# EAGLE design 1500015_ICLED_Featherwing_HW-V1-0 (EAGLE 7.5.0)

## Sheet 1 of 7
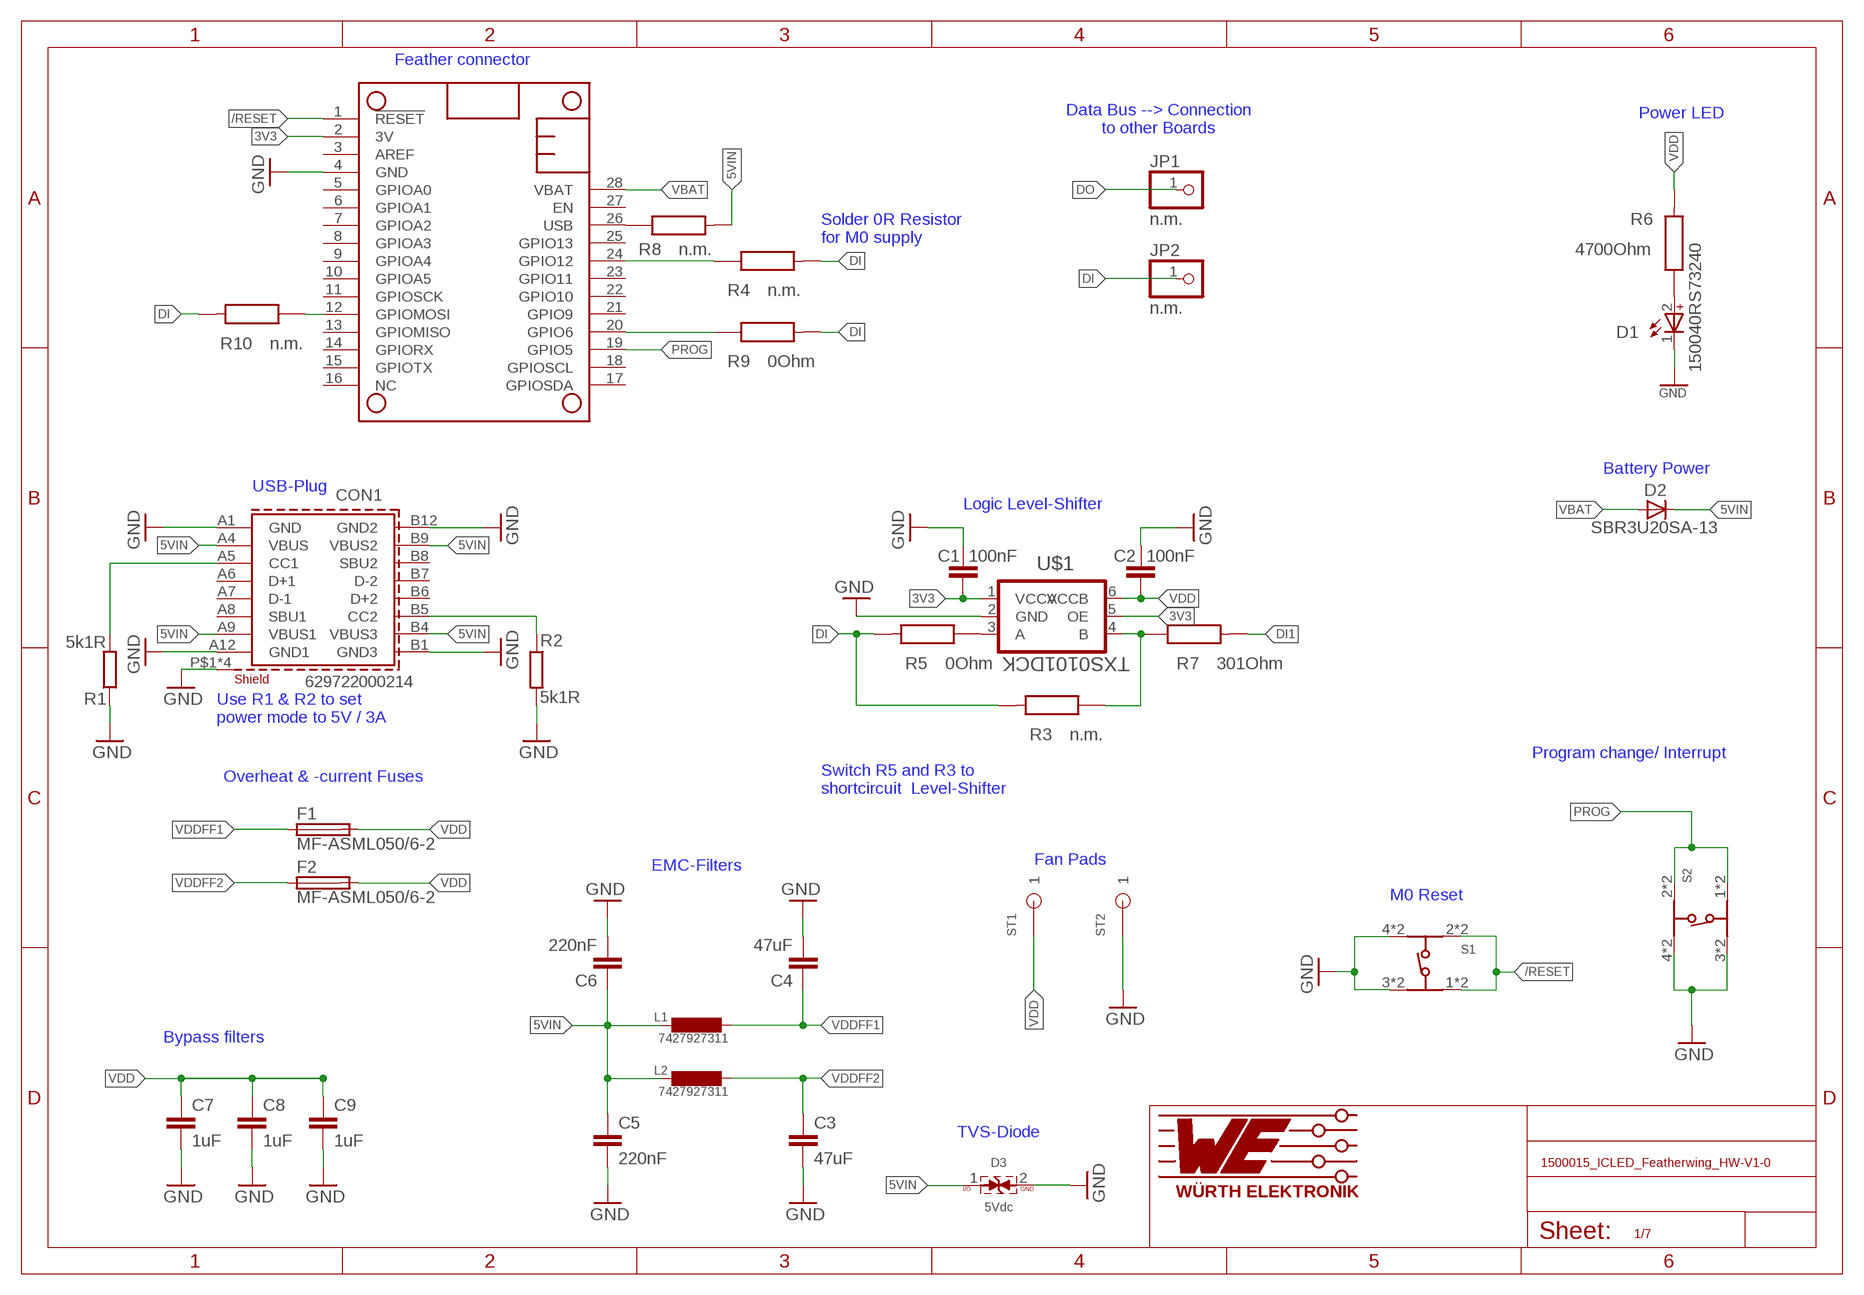
[diagram p0: schematic, sheet 1]

### Parts
C1  100nF  C100NF0402_IPC  [C0402_IPC]
C2  100nF  C100NF0402_IPC  [C0402_IPC]
C3  47uF  C0805  [C0805]
C4  47uF  C0805  [C0805]
C5  220nF  C220N0603_IPC  [C0603_IPC]
C6  220nF  C220N0603_IPC  [C0603_IPC]
C7  1uF  C1UF0402_IPC  [C0402_IPC]
C8  1uF  C1UF0402_IPC  [C0402_IPC]
C9  1uF  C1UF0402_IPC  [C0402_IPC]
CON1  629722000214  [629722000214]
D1  150040RS73240  WL-SMCC_0402_150040RS73240  [WL-SMCC_0402]
D2  SBR3U20SA-13  [SBR3U20SA]
D3  5Vdc  WE-TVS_DFN1610-2L_824032815  [WE-TVS_DFN1610-2L]
F1  MF-ASML050/6-2  ERB-RD2R00X  [0402]
F2  MF-ASML050/6-2  ERB-RD2R00X  [0402]
JP1  n.m.  PINHD-1X1/R  [1X01/R]
JP2  n.m.  PINHD-1X1/R  [1X01/R]
L1  7427927311  LL0402_WE_FERRIT  [L0402_WE_FERRIT]
L2  7427927311  LL0402_WE_FERRIT  [L0402_WE_FERRIT]
MS1  FEATHERWING  [FEATHERWING]
R1  5k1R  R10KR0402_IPC  [R0402_IPC]
R2  5k1R  R10KR0402_IPC  [R0402_IPC]
R3  n.m.  WRIS-RSKS_0603_560112116001_WAVE  [WRIS-RSKS_0603_WAVE]
R4  n.m.  WRIS-RSKS_0402_560112110001  [WRIS-RSKS_0402]
R5  0Ohm  WRIS-RSKS_0603_560112116001_WAVE  [WRIS-RSKS_0603_WAVE]
R6  4700Ohm  WRIS-RSKS_0402_560112110245  [WRIS-RSKS_0402]
R7  301Ohm  WRIS-RSKS_0402_560112110092  [WRIS-RSKS_0402]
R8  n.m.  WRIS-RSKS_0402_560112110001  [WRIS-RSKS_0402]
R9  0Ohm  WRIS-RSKS_0603_560112116001_WAVE  [WRIS-RSKS_0603_WAVE]
R10  n.m.  WRIS-RSKS_0603_560112116001_WAVE  [WRIS-RSKS_0603_WAVE]
S1  434331013822  434331013822_ANGEPASST  [434331013822_ICLEDFW_ANGEPASST]
S2  434331013822  434331013822_ANGEPASST  [434331013822_ICLEDFW_ANGEPASST]
ST1  1_5X1MM  [1_5X1MM]
ST2  1_5X1MM  [1_5X1MM]
U$1  TXS0101DCK  [SC70]

### Nets
3V3: C1.2 MS1.2(3V) U$1.1(VCCA) U$1.5(OE)
5VIN: C5.1 C6.1 CON1.A4(VBUS) CON1.A9(VBUS1) CON1.B4(VBUS3) CON1.B9(VBUS2) D2.K(C) D3.1(I/O) L1.P$2 L2.P$2 R8.2
/RESET: MS1.1(!RESET) S1.1 S1.2 S1.7 S1.8
DI: JP2.1 R3.2 R4.2 R5.2 R9.2 R10.2
DI1: R7.2 ; also sheet 2
DILS: R3.1 R7.1 U$1.4(B)
DO: JP1.1 ; also sheet 7
GND: C1.1 C2.1 C3.P$2 C4.P$2 C5.2 C6.2 C7.2 C8.2 C9.2 CON1.A1(GND) CON1.A12(GND1) CON1.B1(GND3) CON1.B12(GND2) CON1.P$1(SHIELD) CON1.P$2(SHIELD) CON1.P$3(SHIELD) CON1.P$4(SHIELD) D1.1(-) D3.2(GND) MS1.4(GND) R1.1 R2.2 S1.3 S1.4 S1.5 S1.6 S2.3 S2.4 S2.5 S2.6 ST2.1 U$1.2(GND) ; also sheet 2,3,4,5,6,7
GPIO6: MS1.20(GPIO6) R9.1
GPIO12: MS1.24(GPIO12) R4.1
MOSI: MS1.12(GPIOMOSI) R10.1
N$2: CON1.A5(CC1) R1.2
N$3: CON1.B5(CC2) R2.1
N$5: R5.1 U$1.3(A)
N$6: D1.2(+) R6.1
PROG: MS1.19(GPIO5) S2.1 S2.2 S2.7 S2.8
USB: MS1.26(USB) R8.1
VBAT: D2.A MS1.28(VBAT)
VDD: C2.2 C7.1 C8.1 C9.1 F1.2 F2.2 R6.2 ST1.1 U$1.6(VCCB) ; also sheet 2,3,4,5,6,7
VDDFF1: C4.P$1 F1.1 L1.P$1
VDDFF2: C3.P$1 F2.1 L2.P$1
Unconnected: CON1.A6(D+1) CON1.A7(D-1) CON1.A8(SBU1) CON1.B6(D+2) CON1.B7(D-2) CON1.B8(SBU2) MS1.3(AREF) MS1.5(GPIOA0) MS1.6(GPIOA1) MS1.7(GPIOA2) MS1.8(GPIOA3) MS1.9(GPIOA4) MS1.10(GPIOA5) MS1.11(GPIOSCK) MS1.13(GPIOMISO) MS1.14(GPIORX) MS1.15(GPIOTX) MS1.16(NC) MS1.17(GPIOSDA) MS1.18(GPIOSCL) MS1.21(GPIO9) MS1.22(GPIO10) MS1.23(GPIO11) MS1.25(GPIO13) MS1.27(EN)

### Notes on the sheet
- Feather connector
- Data Bus --> Connection
  to other Boards
- Power LED
- Solder 0R Resistor
  for M0 supply
- Battery Power
- USB-Plug
- Logic Level-Shifter
- Use R1 & R2 to set
  power mode to 5V / 3A
- Program change/ Interrupt
- Overheat & -current Fuses
- Switch R5 and R3 to 
  shortcircuit  Level-Shifter
- EMC-Filters | Fan Pads
- M0 Reset
- Bypass filters
- TVS-Diode

## Sheet 2 of 7
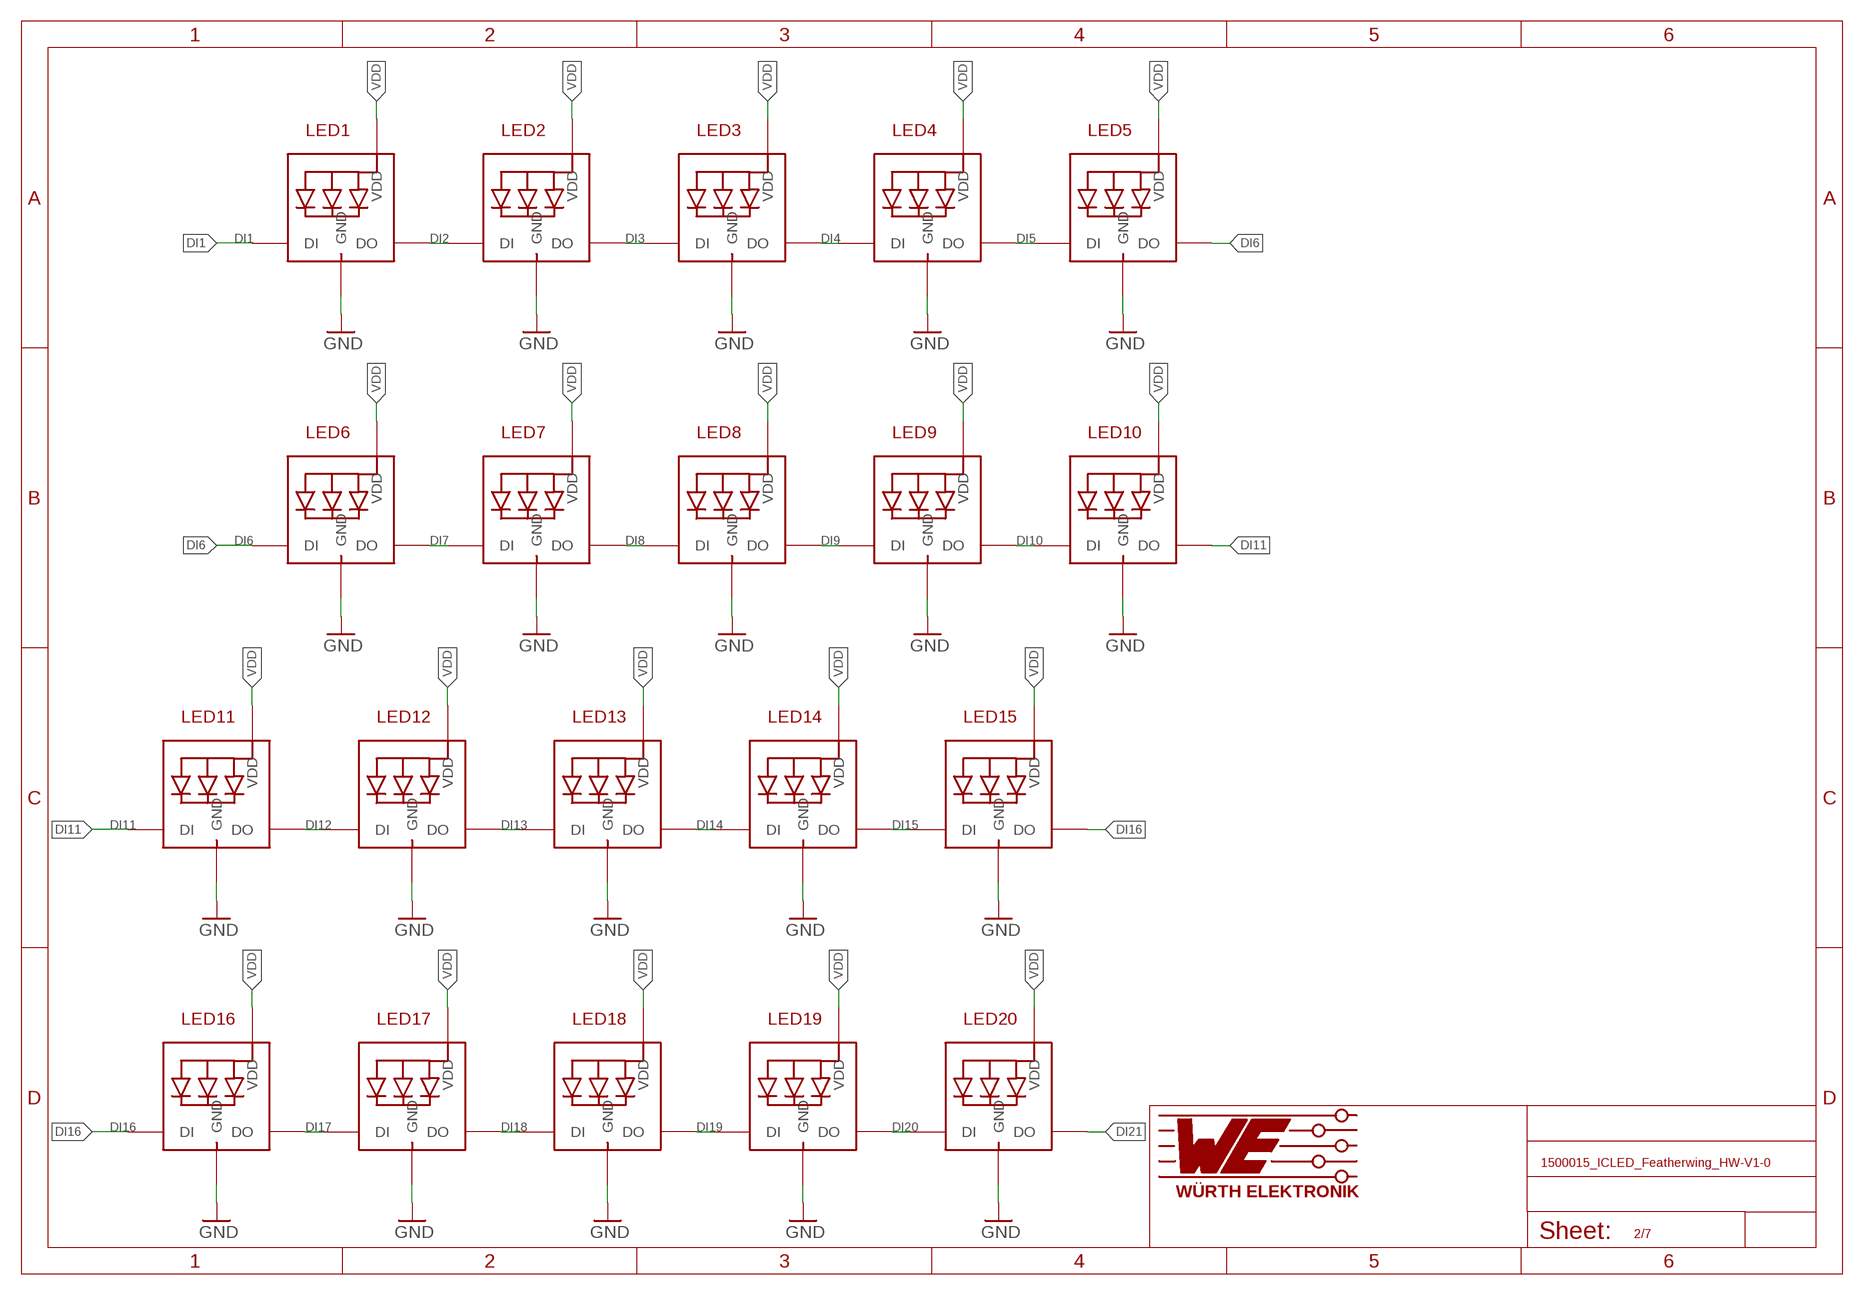
[diagram p1: schematic, sheet 2]

### Parts
LED1  1312020030000  [1312020030000_FWANGEPASST]
LED2  1312020030000  [1312020030000_FWANGEPASST]
LED3  1312020030000  [1312020030000_FWANGEPASST]
LED4  1312020030000  [1312020030000_FWANGEPASST]
LED5  1312020030000  [1312020030000_FWANGEPASST]
LED6  1312020030000  [1312020030000_FWANGEPASST]
LED7  1312020030000  [1312020030000_FWANGEPASST]
LED8  1312020030000  [1312020030000_FWANGEPASST]
LED9  1312020030000  [1312020030000_FWANGEPASST]
LED10  1312020030000  [1312020030000_FWANGEPASST]
LED11  1312020030000  [1312020030000_FWANGEPASST]
LED12  1312020030000  [1312020030000_FWANGEPASST]
LED13  1312020030000  [1312020030000_FWANGEPASST]
LED14  1312020030000  [1312020030000_FWANGEPASST]
LED15  1312020030000  [1312020030000_FWANGEPASST]
LED16  1312020030000  [1312020030000_FWANGEPASST]
LED17  1312020030000  [1312020030000_FWANGEPASST]
LED18  1312020030000  [1312020030000_FWANGEPASST]
LED19  1312020030000  [1312020030000_FWANGEPASST]
LED20  1312020030000  [1312020030000_FWANGEPASST]

### Nets
DI1: LED1.3-DIN(DI) ; also sheet 1
DI2: LED1.1-DOUT(DO) LED2.3-DIN(DI)
DI3: LED2.1-DOUT(DO) LED3.3-DIN(DI)
DI4: LED3.1-DOUT(DO) LED4.3-DIN(DI)
DI5: LED4.1-DOUT(DO) LED5.3-DIN(DI)
DI6: LED5.1-DOUT(DO) LED6.3-DIN(DI)
DI7: LED6.1-DOUT(DO) LED7.3-DIN(DI)
DI8: LED7.1-DOUT(DO) LED8.3-DIN(DI)
DI9: LED8.1-DOUT(DO) LED9.3-DIN(DI)
DI10: LED9.1-DOUT(DO) LED10.3-DIN(DI)
DI11: LED10.1-DOUT(DO) LED11.3-DIN(DI)
DI12: LED11.1-DOUT(DO) LED12.3-DIN(DI)
DI13: LED12.1-DOUT(DO) LED13.3-DIN(DI)
DI14: LED13.1-DOUT(DO) LED14.3-DIN(DI)
DI15: LED14.1-DOUT(DO) LED15.3-DIN(DI)
DI16: LED15.1-DOUT(DO) LED16.3-DIN(DI)
DI17: LED16.1-DOUT(DO) LED17.3-DIN(DI)
DI18: LED17.1-DOUT(DO) LED18.3-DIN(DI)
DI19: LED18.1-DOUT(DO) LED19.3-DIN(DI)
DI20: LED19.1-DOUT(DO) LED20.3-DIN(DI)
DI21: LED20.1-DOUT(DO) ; also sheet 3
GND: LED1.4-GND(GND) LED2.4-GND(GND) LED3.4-GND(GND) LED4.4-GND(GND) LED5.4-GND(GND) LED6.4-GND(GND) LED7.4-GND(GND) LED8.4-GND(GND) LED9.4-GND(GND) LED10.4-GND(GND) LED11.4-GND(GND) LED12.4-GND(GND) LED13.4-GND(GND) LED14.4-GND(GND) LED15.4-GND(GND) LED16.4-GND(GND) LED17.4-GND(GND) LED18.4-GND(GND) LED19.4-GND(GND) LED20.4-GND(GND) ; also sheet 1,3,4,5,6,7
VDD: LED1.2-VDD(VDD) LED2.2-VDD(VDD) LED3.2-VDD(VDD) LED4.2-VDD(VDD) LED5.2-VDD(VDD) LED6.2-VDD(VDD) LED7.2-VDD(VDD) LED8.2-VDD(VDD) LED9.2-VDD(VDD) LED10.2-VDD(VDD) LED11.2-VDD(VDD) LED12.2-VDD(VDD) LED13.2-VDD(VDD) LED14.2-VDD(VDD) LED15.2-VDD(VDD) LED16.2-VDD(VDD) LED17.2-VDD(VDD) LED18.2-VDD(VDD) LED19.2-VDD(VDD) LED20.2-VDD(VDD) ; also sheet 1,3,4,5,6,7

## Sheet 3 of 7
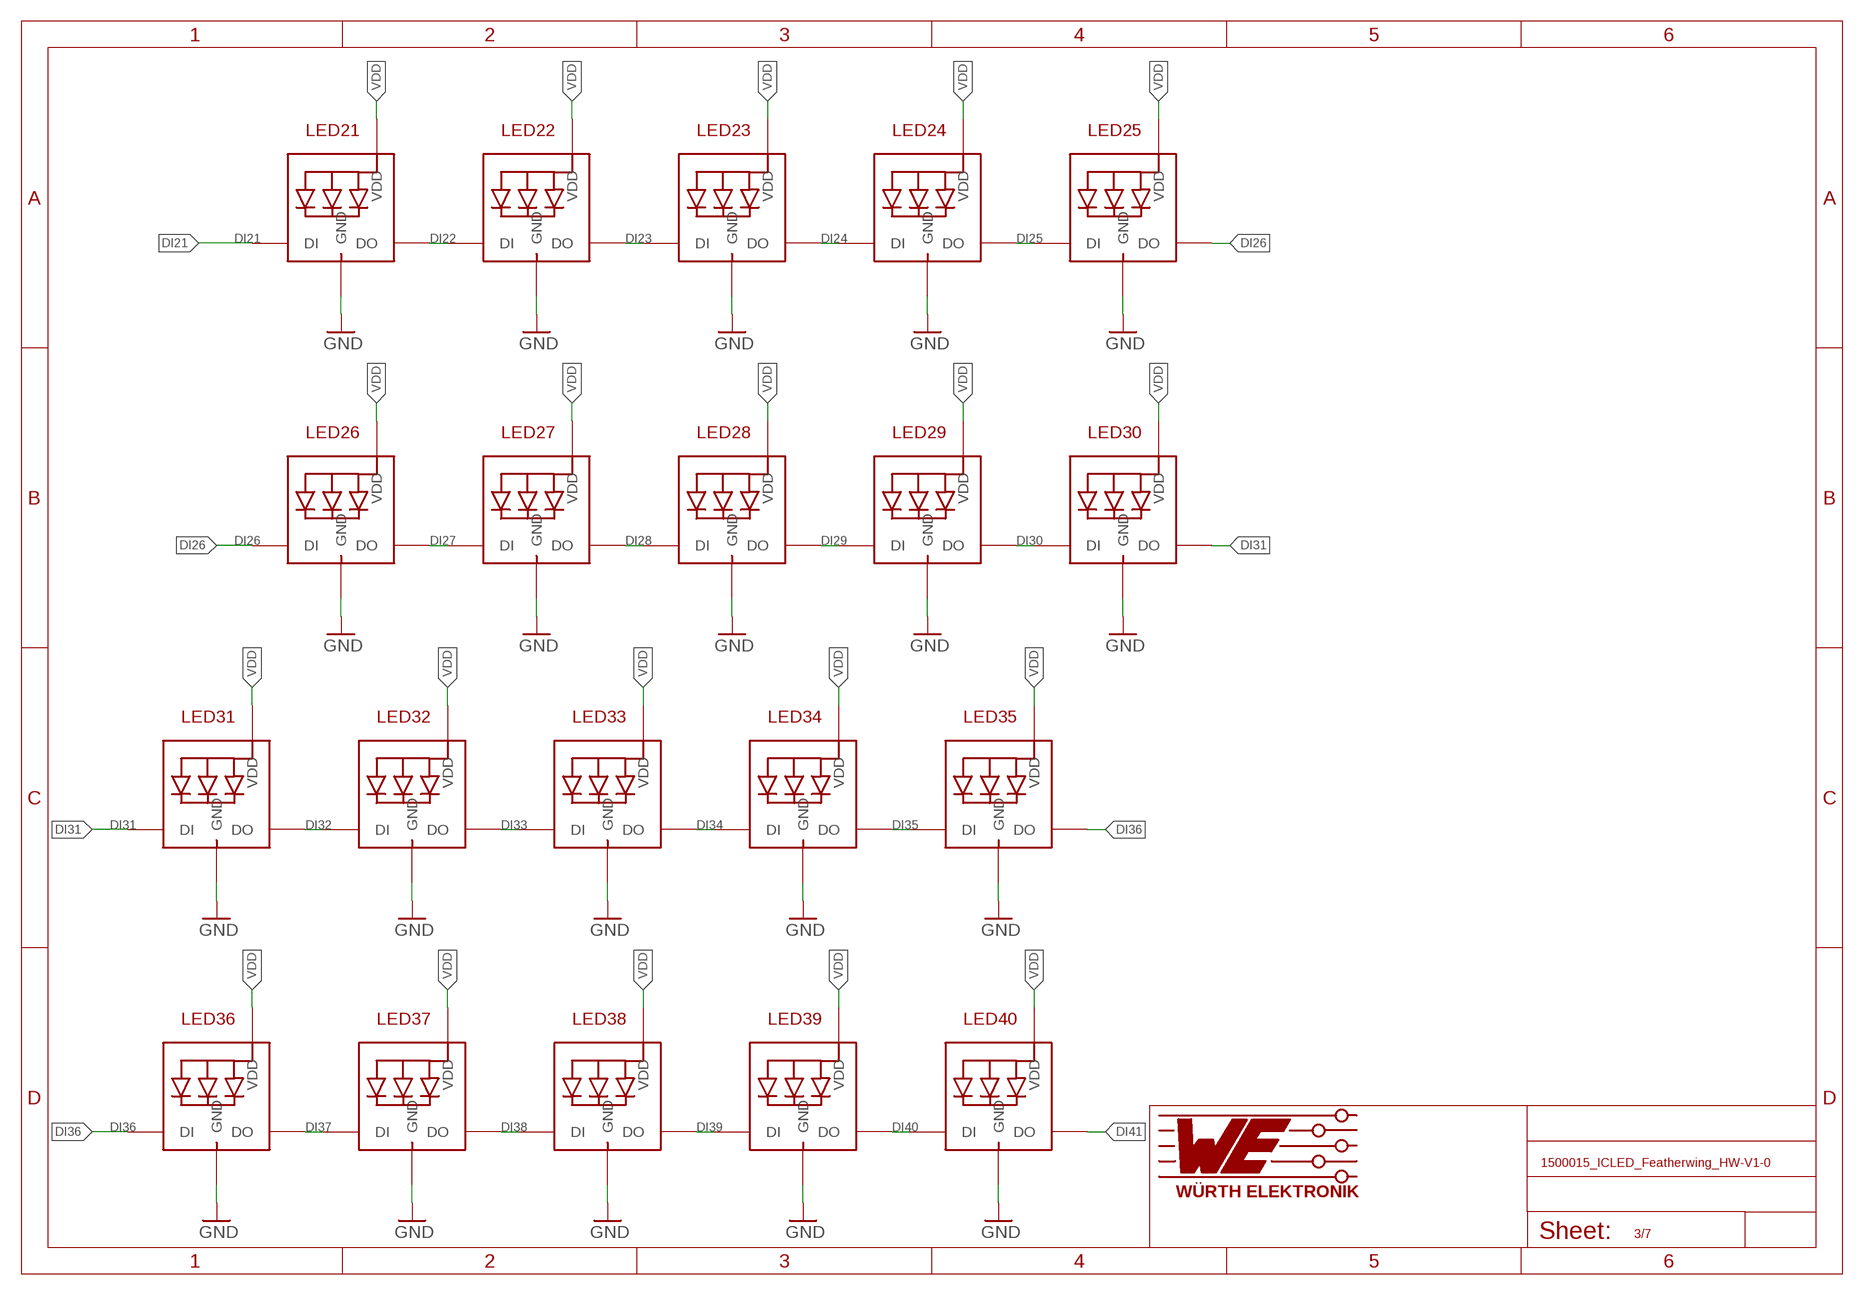
[diagram p2: schematic, sheet 3]

### Parts
LED21  1312020030000  [1312020030000_FWANGEPASST]
LED22  1312020030000  [1312020030000_FWANGEPASST]
LED23  1312020030000  [1312020030000_FWANGEPASST]
LED24  1312020030000  [1312020030000_FWANGEPASST]
LED25  1312020030000  [1312020030000_FWANGEPASST]
LED26  1312020030000  [1312020030000_FWANGEPASST]
LED27  1312020030000  [1312020030000_FWANGEPASST]
LED28  1312020030000  [1312020030000_FWANGEPASST]
LED29  1312020030000  [1312020030000_FWANGEPASST]
LED30  1312020030000  [1312020030000_FWANGEPASST]
LED31  1312020030000  [1312020030000_FWANGEPASST]
LED32  1312020030000  [1312020030000_FWANGEPASST]
LED33  1312020030000  [1312020030000_FWANGEPASST]
LED34  1312020030000  [1312020030000_FWANGEPASST]
LED35  1312020030000  [1312020030000_FWANGEPASST]
LED36  1312020030000  [1312020030000_FWANGEPASST]
LED37  1312020030000  [1312020030000_FWANGEPASST]
LED38  1312020030000  [1312020030000_FWANGEPASST]
LED39  1312020030000  [1312020030000_FWANGEPASST]
LED40  1312020030000  [1312020030000_FWANGEPASST]

### Nets
DI21: LED21.3-DIN(DI) ; also sheet 2
DI22: LED21.1-DOUT(DO) LED22.3-DIN(DI)
DI23: LED22.1-DOUT(DO) LED23.3-DIN(DI)
DI24: LED23.1-DOUT(DO) LED24.3-DIN(DI)
DI25: LED24.1-DOUT(DO) LED25.3-DIN(DI)
DI26: LED25.1-DOUT(DO) LED26.3-DIN(DI)
DI27: LED26.1-DOUT(DO) LED27.3-DIN(DI)
DI28: LED27.1-DOUT(DO) LED28.3-DIN(DI)
DI29: LED28.1-DOUT(DO) LED29.3-DIN(DI)
DI30: LED29.1-DOUT(DO) LED30.3-DIN(DI)
DI31: LED30.1-DOUT(DO) LED31.3-DIN(DI)
DI32: LED31.1-DOUT(DO) LED32.3-DIN(DI)
DI33: LED32.1-DOUT(DO) LED33.3-DIN(DI)
DI34: LED33.1-DOUT(DO) LED34.3-DIN(DI)
DI35: LED34.1-DOUT(DO) LED35.3-DIN(DI)
DI36: LED35.1-DOUT(DO) LED36.3-DIN(DI)
DI37: LED36.1-DOUT(DO) LED37.3-DIN(DI)
DI38: LED37.1-DOUT(DO) LED38.3-DIN(DI)
DI39: LED38.1-DOUT(DO) LED39.3-DIN(DI)
DI40: LED39.1-DOUT(DO) LED40.3-DIN(DI)
DI41: LED40.1-DOUT(DO) ; also sheet 4
GND: LED21.4-GND(GND) LED22.4-GND(GND) LED23.4-GND(GND) LED24.4-GND(GND) LED25.4-GND(GND) LED26.4-GND(GND) LED27.4-GND(GND) LED28.4-GND(GND) LED29.4-GND(GND) LED30.4-GND(GND) LED31.4-GND(GND) LED32.4-GND(GND) LED33.4-GND(GND) LED34.4-GND(GND) LED35.4-GND(GND) LED36.4-GND(GND) LED37.4-GND(GND) LED38.4-GND(GND) LED39.4-GND(GND) LED40.4-GND(GND) ; also sheet 1,2,4,5,6,7
VDD: LED21.2-VDD(VDD) LED22.2-VDD(VDD) LED23.2-VDD(VDD) LED24.2-VDD(VDD) LED25.2-VDD(VDD) LED26.2-VDD(VDD) LED27.2-VDD(VDD) LED28.2-VDD(VDD) LED29.2-VDD(VDD) LED30.2-VDD(VDD) LED31.2-VDD(VDD) LED32.2-VDD(VDD) LED33.2-VDD(VDD) LED34.2-VDD(VDD) LED35.2-VDD(VDD) LED36.2-VDD(VDD) LED37.2-VDD(VDD) LED38.2-VDD(VDD) LED39.2-VDD(VDD) LED40.2-VDD(VDD) ; also sheet 1,2,4,5,6,7

## Sheet 4 of 7
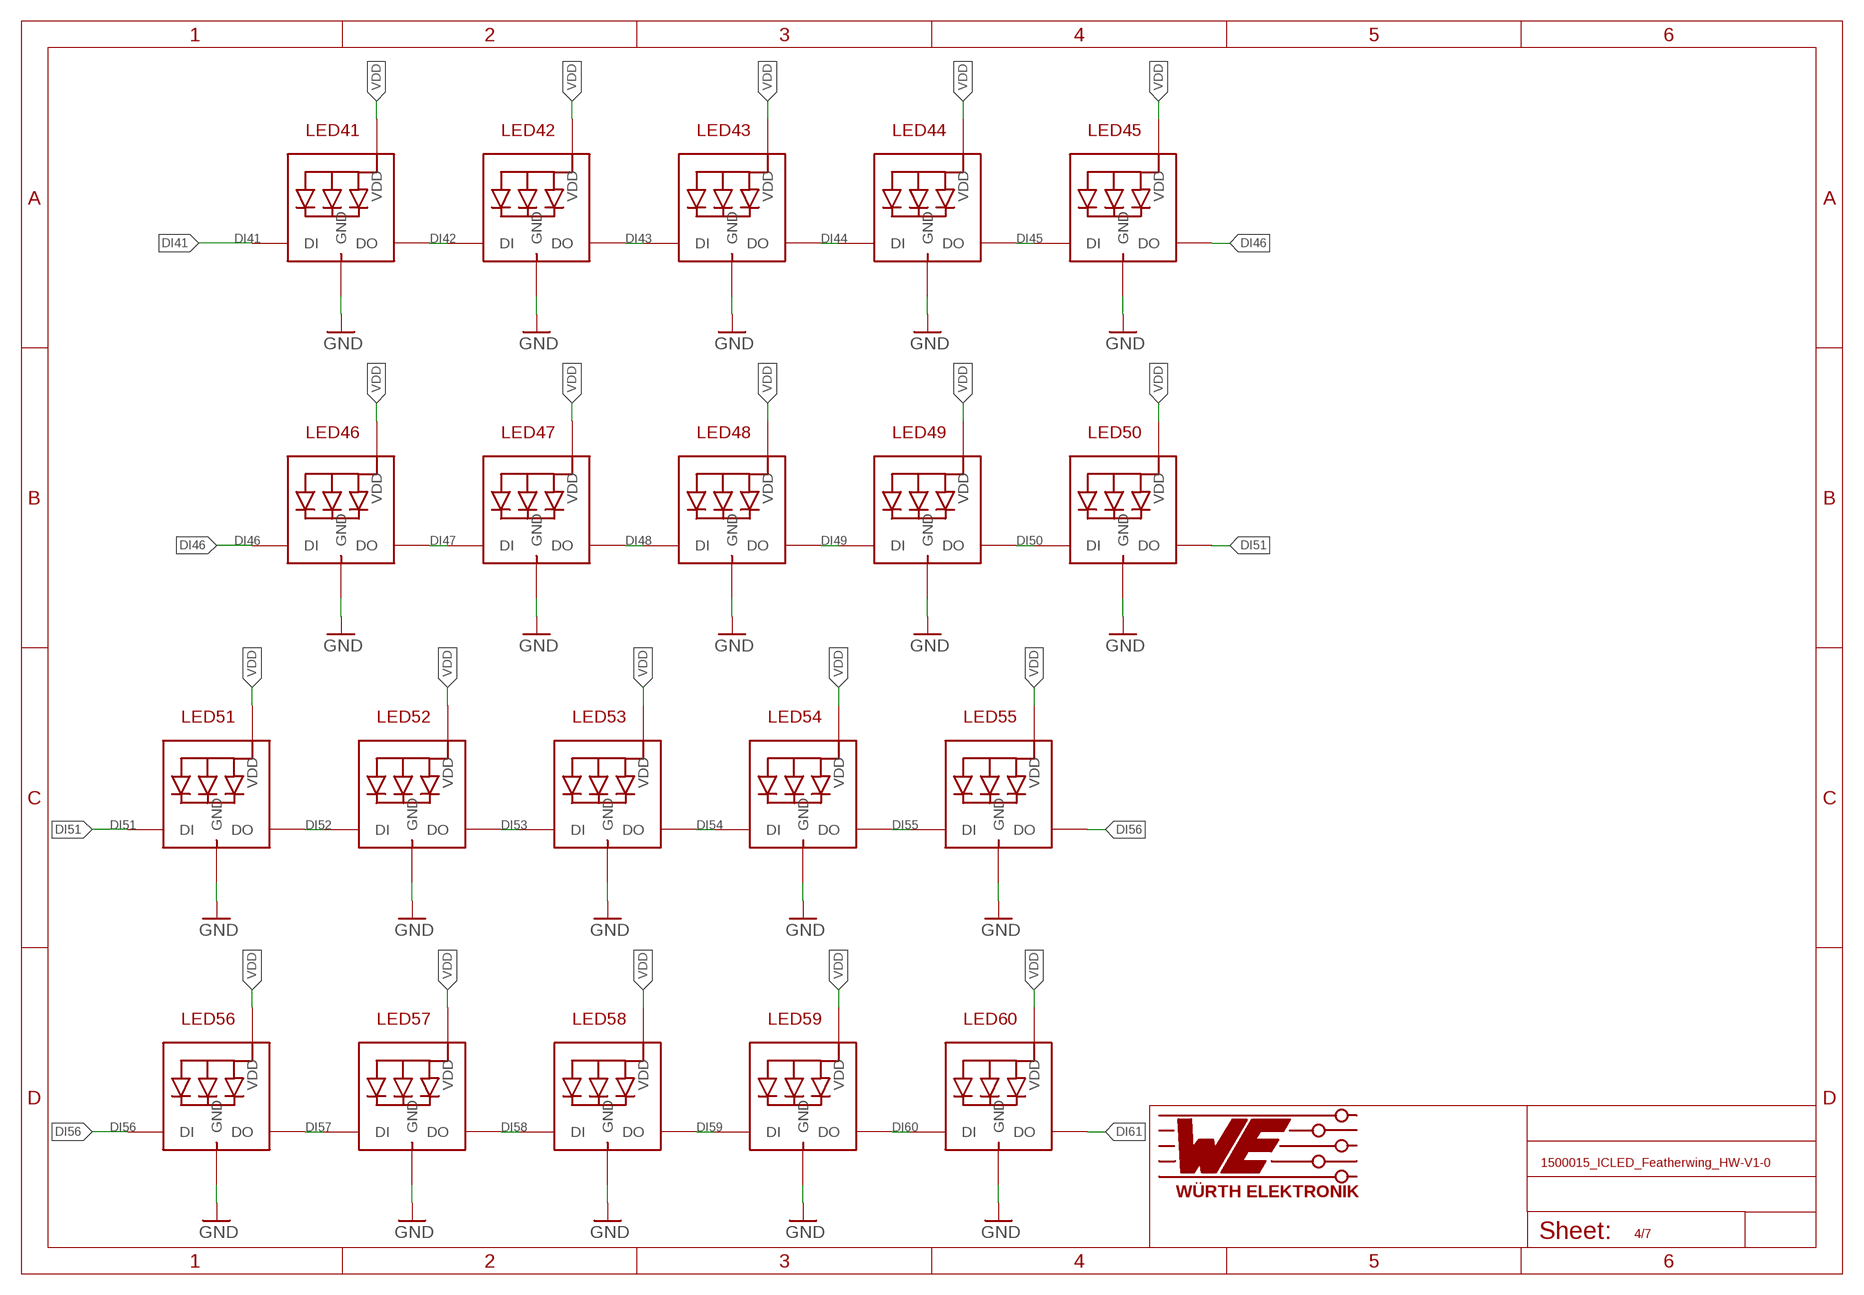
[diagram p3: schematic, sheet 4]

### Parts
LED41  1312020030000  [1312020030000_FWANGEPASST]
LED42  1312020030000  [1312020030000_FWANGEPASST]
LED43  1312020030000  [1312020030000_FWANGEPASST]
LED44  1312020030000  [1312020030000_FWANGEPASST]
LED45  1312020030000  [1312020030000_FWANGEPASST]
LED46  1312020030000  [1312020030000_FWANGEPASST]
LED47  1312020030000  [1312020030000_FWANGEPASST]
LED48  1312020030000  [1312020030000_FWANGEPASST]
LED49  1312020030000  [1312020030000_FWANGEPASST]
LED50  1312020030000  [1312020030000_FWANGEPASST]
LED51  1312020030000  [1312020030000_FWANGEPASST]
LED52  1312020030000  [1312020030000_FWANGEPASST]
LED53  1312020030000  [1312020030000_FWANGEPASST]
LED54  1312020030000  [1312020030000_FWANGEPASST]
LED55  1312020030000  [1312020030000_FWANGEPASST]
LED56  1312020030000  [1312020030000_FWANGEPASST]
LED57  1312020030000  [1312020030000_FWANGEPASST]
LED58  1312020030000  [1312020030000_FWANGEPASST]
LED59  1312020030000  [1312020030000_FWANGEPASST]
LED60  1312020030000  [1312020030000_FWANGEPASST]

### Nets
DI41: LED41.3-DIN(DI) ; also sheet 3
DI42: LED41.1-DOUT(DO) LED42.3-DIN(DI)
DI43: LED42.1-DOUT(DO) LED43.3-DIN(DI)
DI44: LED43.1-DOUT(DO) LED44.3-DIN(DI)
DI45: LED44.1-DOUT(DO) LED45.3-DIN(DI)
DI46: LED45.1-DOUT(DO) LED46.3-DIN(DI)
DI47: LED46.1-DOUT(DO) LED47.3-DIN(DI)
DI48: LED47.1-DOUT(DO) LED48.3-DIN(DI)
DI49: LED48.1-DOUT(DO) LED49.3-DIN(DI)
DI50: LED49.1-DOUT(DO) LED50.3-DIN(DI)
DI51: LED50.1-DOUT(DO) LED51.3-DIN(DI)
DI52: LED51.1-DOUT(DO) LED52.3-DIN(DI)
DI53: LED52.1-DOUT(DO) LED53.3-DIN(DI)
DI54: LED53.1-DOUT(DO) LED54.3-DIN(DI)
DI55: LED54.1-DOUT(DO) LED55.3-DIN(DI)
DI56: LED55.1-DOUT(DO) LED56.3-DIN(DI)
DI57: LED56.1-DOUT(DO) LED57.3-DIN(DI)
DI58: LED57.1-DOUT(DO) LED58.3-DIN(DI)
DI59: LED58.1-DOUT(DO) LED59.3-DIN(DI)
DI60: LED59.1-DOUT(DO) LED60.3-DIN(DI)
DI61: LED60.1-DOUT(DO) ; also sheet 5
GND: LED41.4-GND(GND) LED42.4-GND(GND) LED43.4-GND(GND) LED44.4-GND(GND) LED45.4-GND(GND) LED46.4-GND(GND) LED47.4-GND(GND) LED48.4-GND(GND) LED49.4-GND(GND) LED50.4-GND(GND) LED51.4-GND(GND) LED52.4-GND(GND) LED53.4-GND(GND) LED54.4-GND(GND) LED55.4-GND(GND) LED56.4-GND(GND) LED57.4-GND(GND) LED58.4-GND(GND) LED59.4-GND(GND) LED60.4-GND(GND) ; also sheet 1,2,3,5,6,7
VDD: LED41.2-VDD(VDD) LED42.2-VDD(VDD) LED43.2-VDD(VDD) LED44.2-VDD(VDD) LED45.2-VDD(VDD) LED46.2-VDD(VDD) LED47.2-VDD(VDD) LED48.2-VDD(VDD) LED49.2-VDD(VDD) LED50.2-VDD(VDD) LED51.2-VDD(VDD) LED52.2-VDD(VDD) LED53.2-VDD(VDD) LED54.2-VDD(VDD) LED55.2-VDD(VDD) LED56.2-VDD(VDD) LED57.2-VDD(VDD) LED58.2-VDD(VDD) LED59.2-VDD(VDD) LED60.2-VDD(VDD) ; also sheet 1,2,3,5,6,7

## Sheet 5 of 7
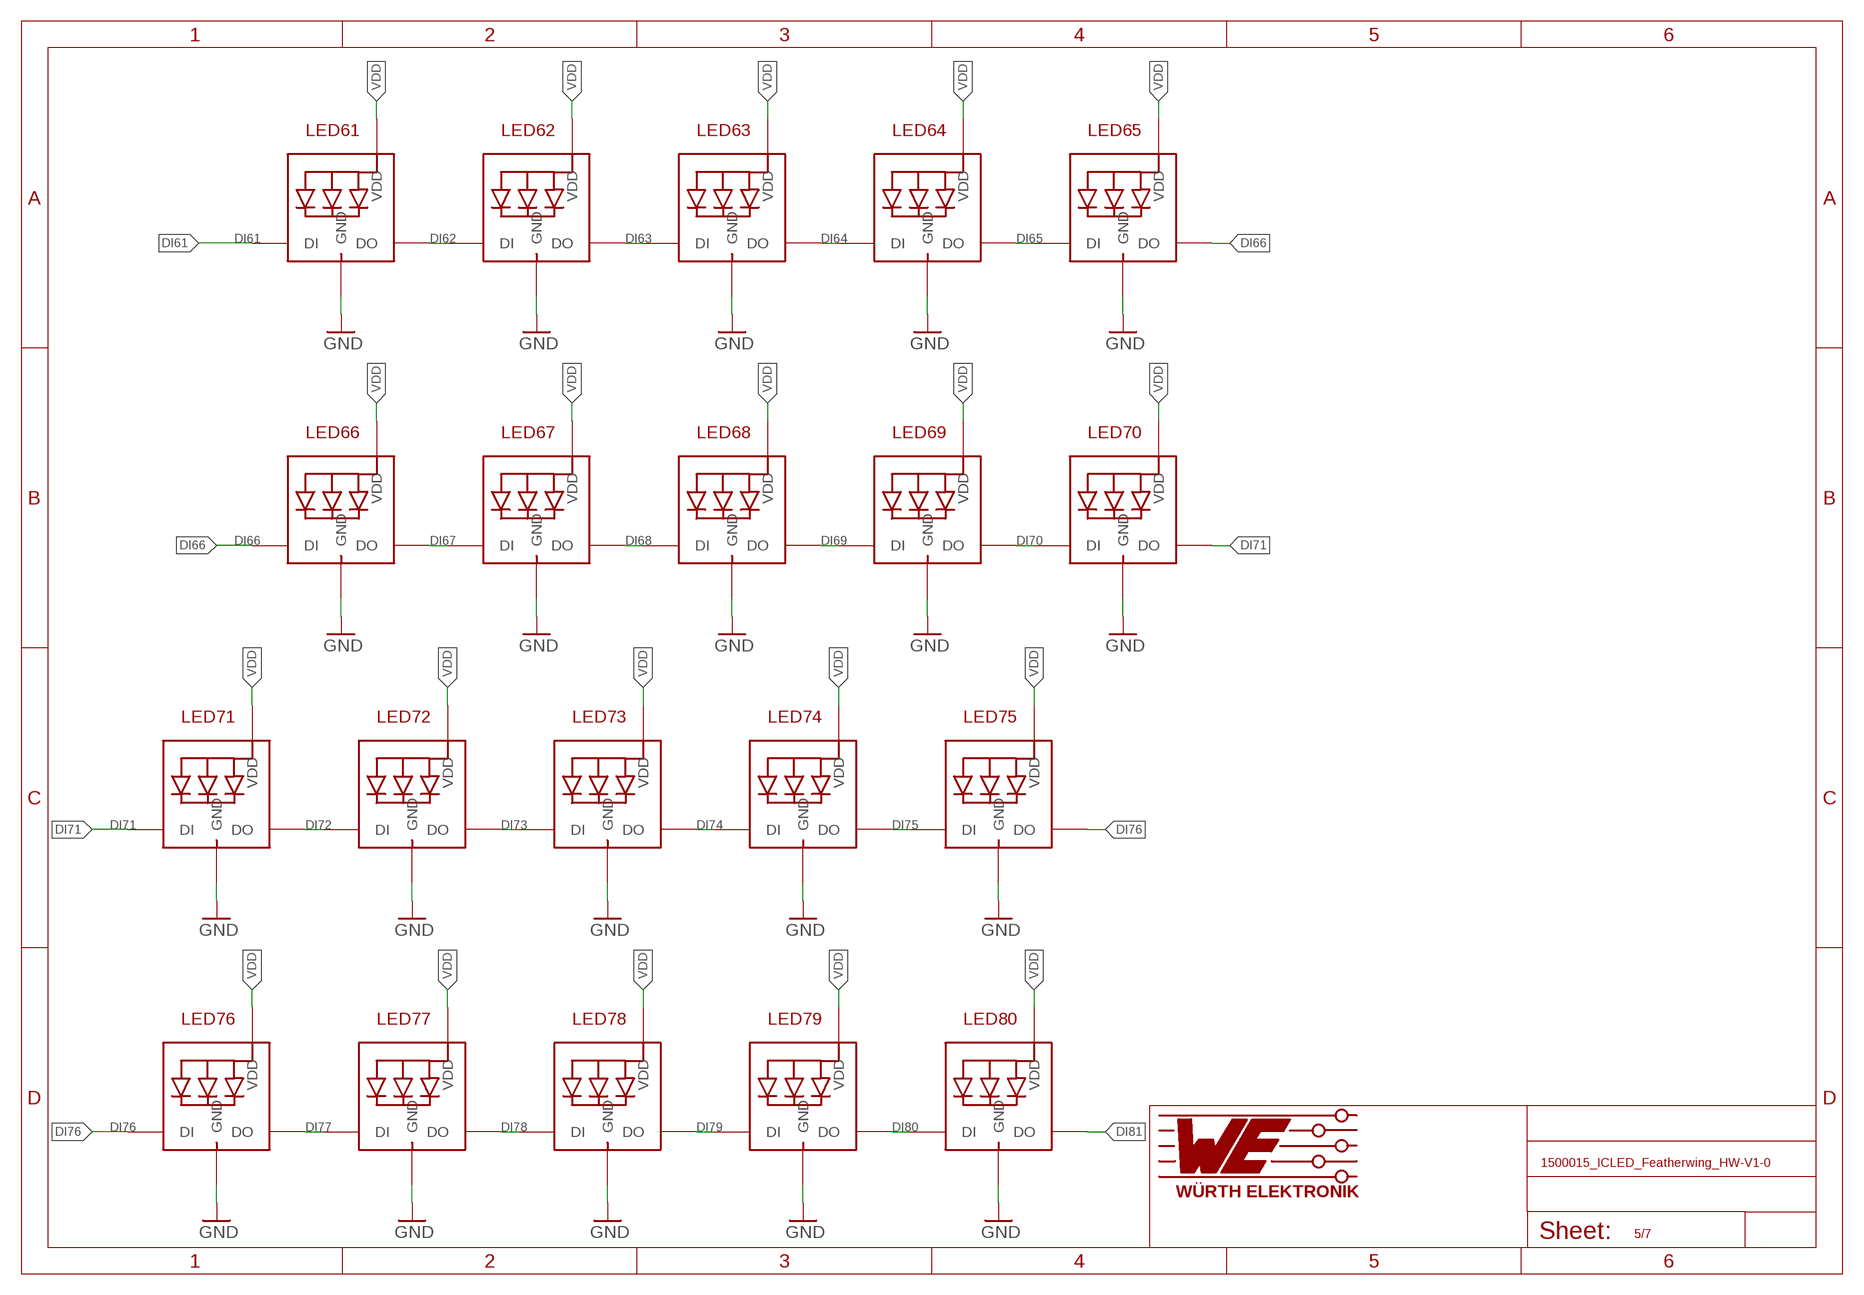
[diagram p4: schematic, sheet 5]

### Parts
LED61  1312020030000  [1312020030000_FWANGEPASST]
LED62  1312020030000  [1312020030000_FWANGEPASST]
LED63  1312020030000  [1312020030000_FWANGEPASST]
LED64  1312020030000  [1312020030000_FWANGEPASST]
LED65  1312020030000  [1312020030000_FWANGEPASST]
LED66  1312020030000  [1312020030000_FWANGEPASST]
LED67  1312020030000  [1312020030000_FWANGEPASST]
LED68  1312020030000  [1312020030000_FWANGEPASST]
LED69  1312020030000  [1312020030000_FWANGEPASST]
LED70  1312020030000  [1312020030000_FWANGEPASST]
LED71  1312020030000  [1312020030000_FWANGEPASST]
LED72  1312020030000  [1312020030000_FWANGEPASST]
LED73  1312020030000  [1312020030000_FWANGEPASST]
LED74  1312020030000  [1312020030000_FWANGEPASST]
LED75  1312020030000  [1312020030000_FWANGEPASST]
LED76  1312020030000  [1312020030000_FWANGEPASST]
LED77  1312020030000  [1312020030000_FWANGEPASST]
LED78  1312020030000  [1312020030000_FWANGEPASST]
LED79  1312020030000  [1312020030000_FWANGEPASST]
LED80  1312020030000  [1312020030000_FWANGEPASST]

### Nets
DI61: LED61.3-DIN(DI) ; also sheet 4
DI62: LED61.1-DOUT(DO) LED62.3-DIN(DI)
DI63: LED62.1-DOUT(DO) LED63.3-DIN(DI)
DI64: LED63.1-DOUT(DO) LED64.3-DIN(DI)
DI65: LED64.1-DOUT(DO) LED65.3-DIN(DI)
DI66: LED65.1-DOUT(DO) LED66.3-DIN(DI)
DI67: LED66.1-DOUT(DO) LED67.3-DIN(DI)
DI68: LED67.1-DOUT(DO) LED68.3-DIN(DI)
DI69: LED68.1-DOUT(DO) LED69.3-DIN(DI)
DI70: LED69.1-DOUT(DO) LED70.3-DIN(DI)
DI71: LED70.1-DOUT(DO) LED71.3-DIN(DI)
DI72: LED71.1-DOUT(DO) LED72.3-DIN(DI)
DI73: LED72.1-DOUT(DO) LED73.3-DIN(DI)
DI74: LED73.1-DOUT(DO) LED74.3-DIN(DI)
DI75: LED74.1-DOUT(DO) LED75.3-DIN(DI)
DI76: LED75.1-DOUT(DO) LED76.3-DIN(DI)
DI77: LED76.1-DOUT(DO) LED77.3-DIN(DI)
DI78: LED77.1-DOUT(DO) LED78.3-DIN(DI)
DI79: LED78.1-DOUT(DO) LED79.3-DIN(DI)
DI80: LED79.1-DOUT(DO) LED80.3-DIN(DI)
DI81: LED80.1-DOUT(DO) ; also sheet 6
GND: LED61.4-GND(GND) LED62.4-GND(GND) LED63.4-GND(GND) LED64.4-GND(GND) LED65.4-GND(GND) LED66.4-GND(GND) LED67.4-GND(GND) LED68.4-GND(GND) LED69.4-GND(GND) LED70.4-GND(GND) LED71.4-GND(GND) LED72.4-GND(GND) LED73.4-GND(GND) LED74.4-GND(GND) LED75.4-GND(GND) LED76.4-GND(GND) LED77.4-GND(GND) LED78.4-GND(GND) LED79.4-GND(GND) LED80.4-GND(GND) ; also sheet 1,2,3,4,6,7
VDD: LED61.2-VDD(VDD) LED62.2-VDD(VDD) LED63.2-VDD(VDD) LED64.2-VDD(VDD) LED65.2-VDD(VDD) LED66.2-VDD(VDD) LED67.2-VDD(VDD) LED68.2-VDD(VDD) LED69.2-VDD(VDD) LED70.2-VDD(VDD) LED71.2-VDD(VDD) LED72.2-VDD(VDD) LED73.2-VDD(VDD) LED74.2-VDD(VDD) LED75.2-VDD(VDD) LED76.2-VDD(VDD) LED77.2-VDD(VDD) LED78.2-VDD(VDD) LED79.2-VDD(VDD) LED80.2-VDD(VDD) ; also sheet 1,2,3,4,6,7

## Sheet 6 of 7
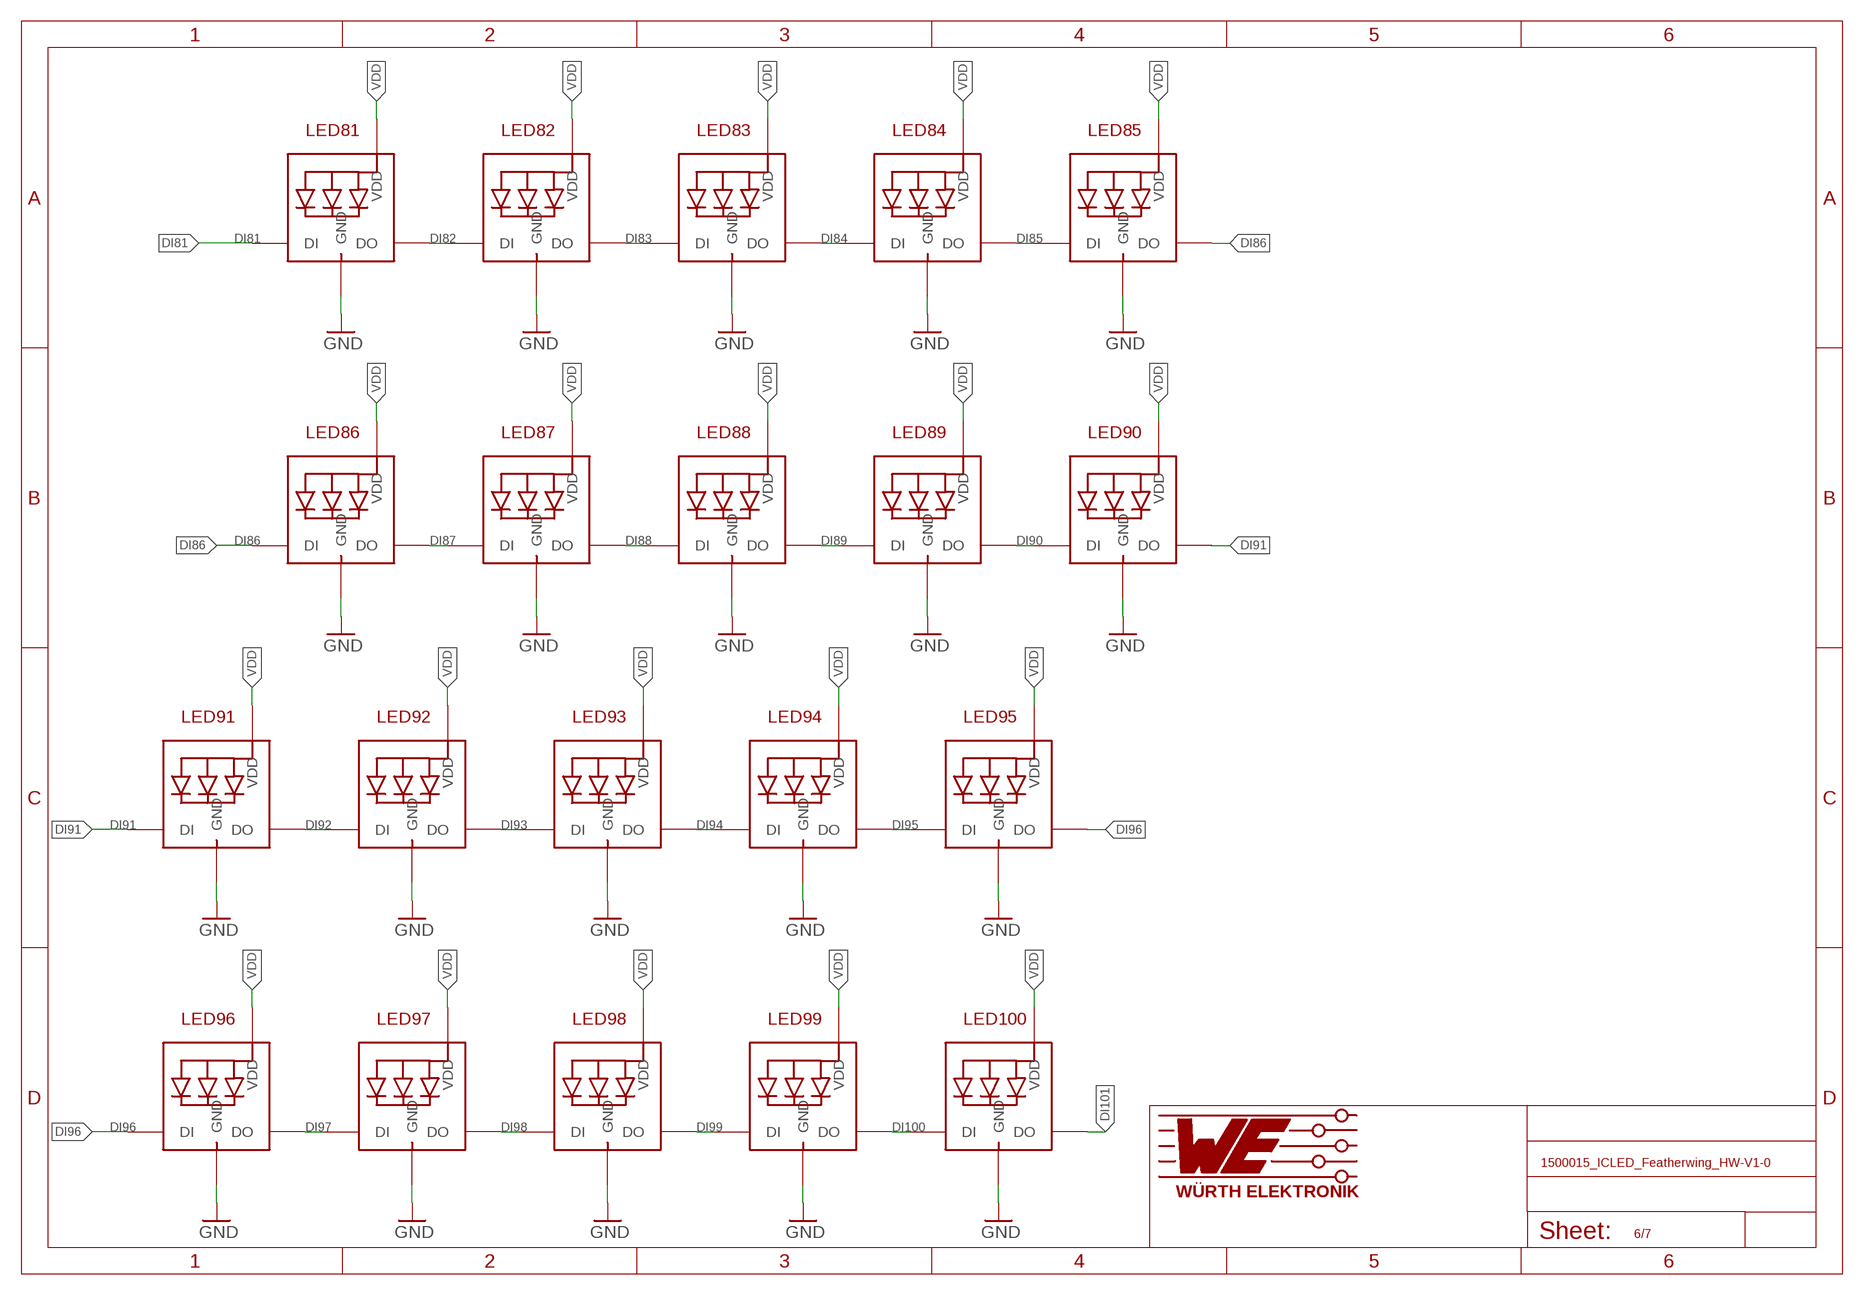
[diagram p5: schematic, sheet 6]

### Parts
LED81  1312020030000  [1312020030000_FWANGEPASST]
LED82  1312020030000  [1312020030000_FWANGEPASST]
LED83  1312020030000  [1312020030000_FWANGEPASST]
LED84  1312020030000  [1312020030000_FWANGEPASST]
LED85  1312020030000  [1312020030000_FWANGEPASST]
LED86  1312020030000  [1312020030000_FWANGEPASST]
LED87  1312020030000  [1312020030000_FWANGEPASST]
LED88  1312020030000  [1312020030000_FWANGEPASST]
LED89  1312020030000  [1312020030000_FWANGEPASST]
LED90  1312020030000  [1312020030000_FWANGEPASST]
LED91  1312020030000  [1312020030000_FWANGEPASST]
LED92  1312020030000  [1312020030000_FWANGEPASST]
LED93  1312020030000  [1312020030000_FWANGEPASST]
LED94  1312020030000  [1312020030000_FWANGEPASST]
LED95  1312020030000  [1312020030000_FWANGEPASST]
LED96  1312020030000  [1312020030000_FWANGEPASST]
LED97  1312020030000  [1312020030000_FWANGEPASST]
LED98  1312020030000  [1312020030000_FWANGEPASST]
LED99  1312020030000  [1312020030000_FWANGEPASST]
LED100  1312020030000  [1312020030000_FWANGEPASST]

### Nets
DI81: LED81.3-DIN(DI) ; also sheet 5
DI82: LED81.1-DOUT(DO) LED82.3-DIN(DI)
DI83: LED82.1-DOUT(DO) LED83.3-DIN(DI)
DI84: LED83.1-DOUT(DO) LED84.3-DIN(DI)
DI85: LED84.1-DOUT(DO) LED85.3-DIN(DI)
DI86: LED85.1-DOUT(DO) LED86.3-DIN(DI)
DI87: LED86.1-DOUT(DO) LED87.3-DIN(DI)
DI88: LED87.1-DOUT(DO) LED88.3-DIN(DI)
DI89: LED88.1-DOUT(DO) LED89.3-DIN(DI)
DI90: LED89.1-DOUT(DO) LED90.3-DIN(DI)
DI91: LED90.1-DOUT(DO) LED91.3-DIN(DI)
DI92: LED91.1-DOUT(DO) LED92.3-DIN(DI)
DI93: LED92.1-DOUT(DO) LED93.3-DIN(DI)
DI94: LED93.1-DOUT(DO) LED94.3-DIN(DI)
DI95: LED94.1-DOUT(DO) LED95.3-DIN(DI)
DI96: LED95.1-DOUT(DO) LED96.3-DIN(DI)
DI97: LED96.1-DOUT(DO) LED97.3-DIN(DI)
DI98: LED97.1-DOUT(DO) LED98.3-DIN(DI)
DI99: LED98.1-DOUT(DO) LED99.3-DIN(DI)
DI100: LED99.1-DOUT(DO) LED100.3-DIN(DI)
DI101: LED100.1-DOUT(DO) ; also sheet 7
GND: LED81.4-GND(GND) LED82.4-GND(GND) LED83.4-GND(GND) LED84.4-GND(GND) LED85.4-GND(GND) LED86.4-GND(GND) LED87.4-GND(GND) LED88.4-GND(GND) LED89.4-GND(GND) LED90.4-GND(GND) LED91.4-GND(GND) LED92.4-GND(GND) LED93.4-GND(GND) LED94.4-GND(GND) LED95.4-GND(GND) LED96.4-GND(GND) LED97.4-GND(GND) LED98.4-GND(GND) LED99.4-GND(GND) LED100.4-GND(GND) ; also sheet 1,2,3,4,5,7
VDD: LED81.2-VDD(VDD) LED82.2-VDD(VDD) LED83.2-VDD(VDD) LED84.2-VDD(VDD) LED85.2-VDD(VDD) LED86.2-VDD(VDD) LED87.2-VDD(VDD) LED88.2-VDD(VDD) LED89.2-VDD(VDD) LED90.2-VDD(VDD) LED91.2-VDD(VDD) LED92.2-VDD(VDD) LED93.2-VDD(VDD) LED94.2-VDD(VDD) LED95.2-VDD(VDD) LED96.2-VDD(VDD) LED97.2-VDD(VDD) LED98.2-VDD(VDD) LED99.2-VDD(VDD) LED100.2-VDD(VDD) ; also sheet 1,2,3,4,5,7

## Sheet 7 of 7
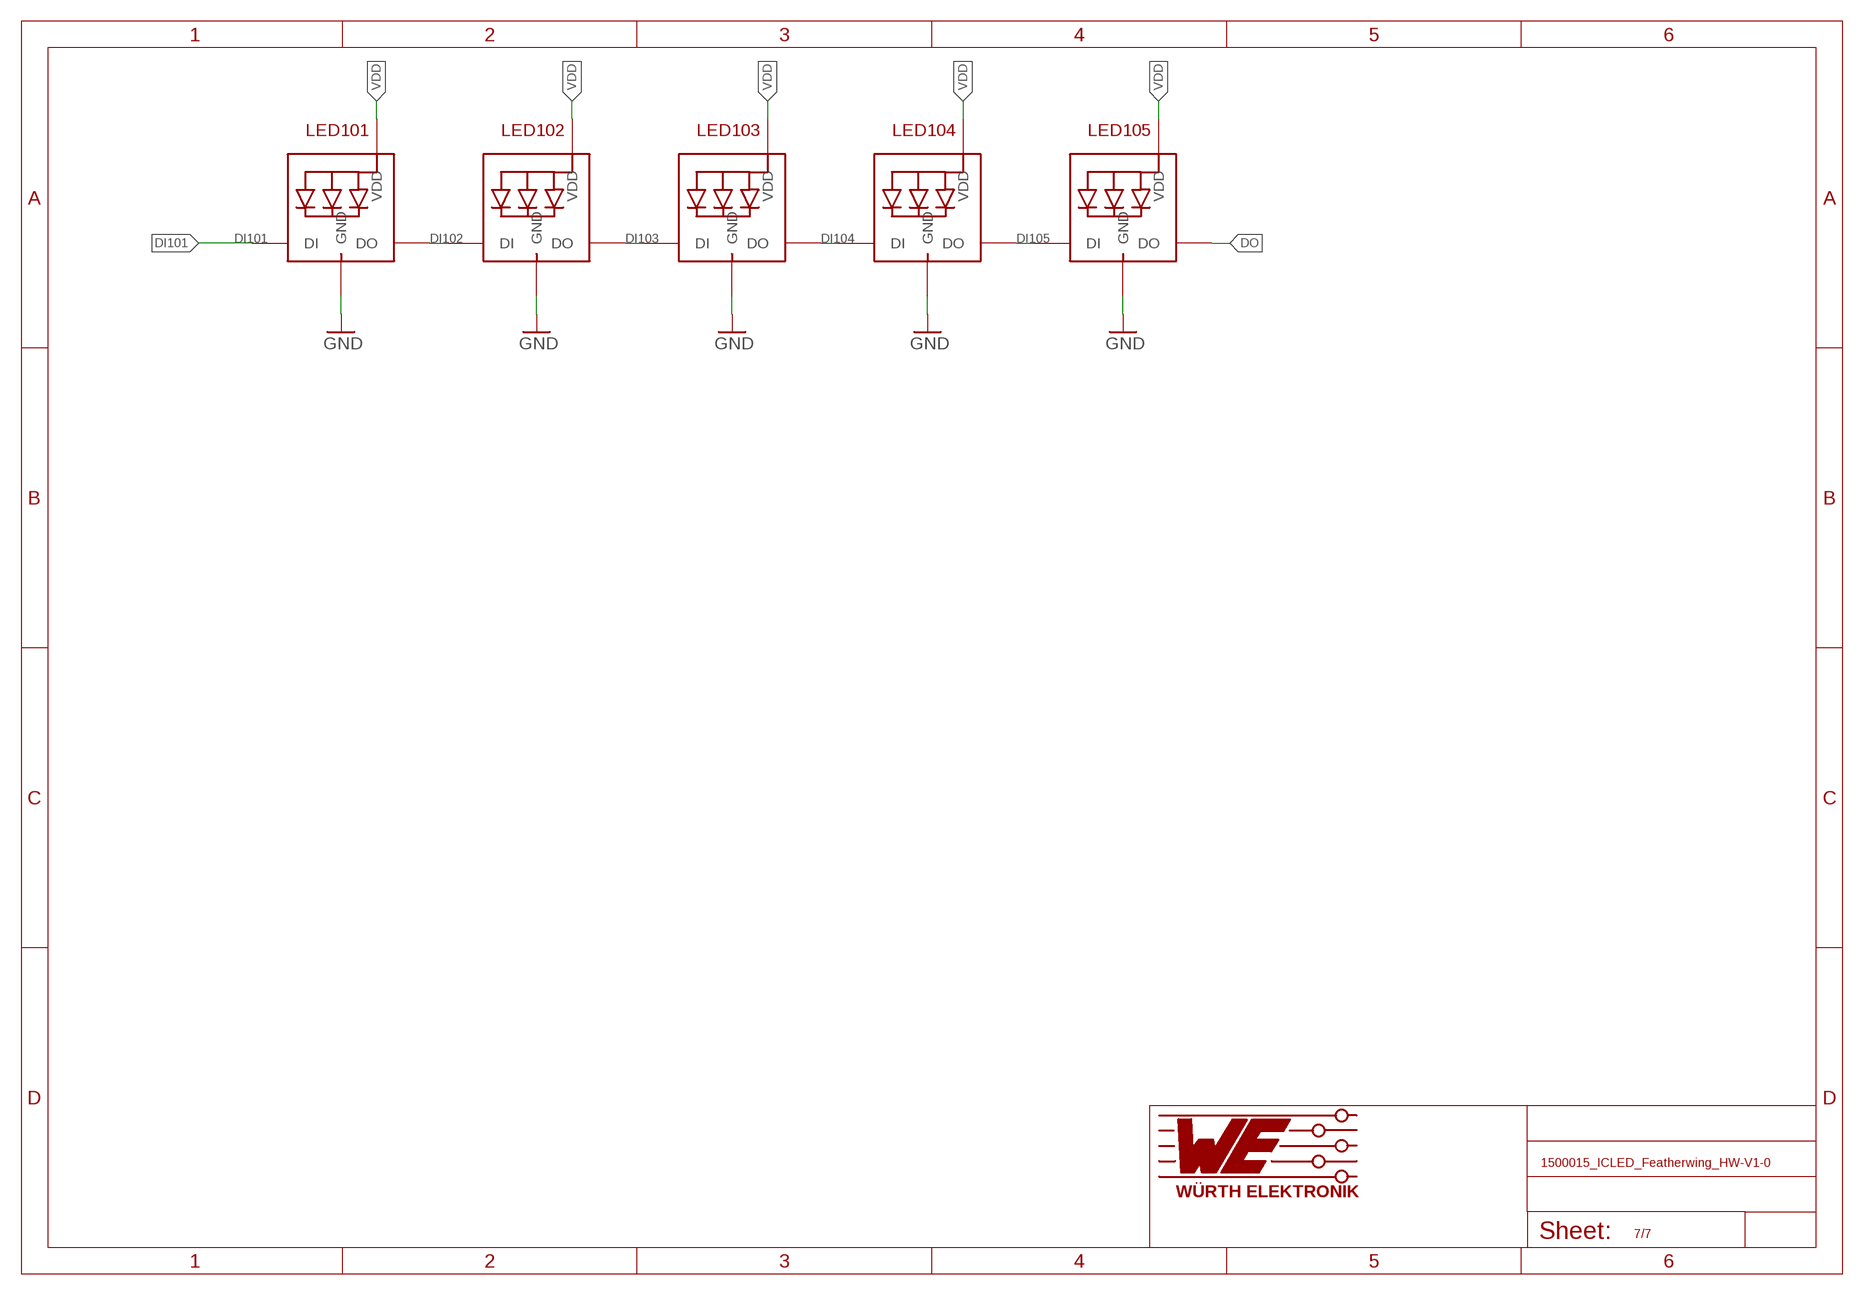
[diagram p6: schematic, sheet 7]

### Parts
LED101  1312020030000  [1312020030000_FWANGEPASST]
LED102  1312020030000  [1312020030000_FWANGEPASST]
LED103  1312020030000  [1312020030000_FWANGEPASST]
LED104  1312020030000  [1312020030000_FWANGEPASST]
LED105  1312020030000  [1312020030000_FWANGEPASST]

### Nets
DI101: LED101.3-DIN(DI) ; also sheet 6
DI102: LED101.1-DOUT(DO) LED102.3-DIN(DI)
DI103: LED102.1-DOUT(DO) LED103.3-DIN(DI)
DI104: LED103.1-DOUT(DO) LED104.3-DIN(DI)
DI105: LED104.1-DOUT(DO) LED105.3-DIN(DI)
DO: LED105.1-DOUT(DO) ; also sheet 1
GND: LED101.4-GND(GND) LED102.4-GND(GND) LED103.4-GND(GND) LED104.4-GND(GND) LED105.4-GND(GND) ; also sheet 1,2,3,4,5,6
VDD: LED101.2-VDD(VDD) LED102.2-VDD(VDD) LED103.2-VDD(VDD) LED104.2-VDD(VDD) LED105.2-VDD(VDD) ; also sheet 1,2,3,4,5,6

## Library data of the parts
C1 C2 = rcl-WE:C; HEIGHT: 0.5mm; MANUFACTURER: Würth Elektronik; MAT: X7R; NR: 885012205037; PACK: 0402; SPG: 16V; TEMP: -55 to +125°C; TOL: 10%
C3 C4 = rcl-WE:C; HEIGHT: 0.7mm; MANUFACTURER: Würth Elektronik; NR: 885012107006; PACKAGE: 0805; SPG: 6.3V
C5 C6 = rcl-WE:C; HEIGHT: 0.8mm; MANUFACTURER: Wurth Elektronik; NR: 885012206125; PACKAGE: 0603; SPG: 50V; TOL: 5%
C7-C9 = rcl-WE:C; HEIGHT: 0.5mm; MANUFACTURER: Würth Elektronik; MAT: X5R; NR: 885012105012; PACK: 0402; SPG: 10V; TOL: 20%
CON1 = Eagle_WR-USB (rev22c):629722000214: WR-COM USB 2.0 Type C Plug Vertical SMT Kind Properties Durability 10 000 Mating cycles Gender Receptacle Type Horizontal General Information Operating Temperature -40 up to +85 °C Electrical Properties Working Voltage 20 V (DC) Withstanding Voltage 100 V (AC) Contact Resistance 40 mΩ Material Properties Insulator Material LCP Insulator Flammability Rating UL94 V-0 Insulator Color Black Contact Material Brass Contact Plating Gold over Nickel Contact Type Stamped Shielding Material Steel Shielding Plating Nickel (Ni) Details see: www.we-online.com/catalog/WR-COM_USB_20_TYPE_C_RECEPTACLE_HORIZONTAL_SMT Updated by Ella Wu 2022-11-15 2022 (C) Würth Elektronik; APPLICATION: USB 2.0; DATASHEET-URL: https://www.we-online.com/redexpert/spec/629722000214?ae; GERDER: Receptacle; INTERFACE-TYPE: Type C; IR: 5A; MOUNT: SMT; PACKAGING: Tape and Reel; PART-NUMBER: 629722000214; PINS: 16; TYPE: Horizontal; WORKING-VOLTAGE: 20V(AC)
D1 = Eagle_WL-SMCC (rev22a):WL-SMCC_0402: WL-SMCC SMT Mono-color Chip LED Compact Characteristics Small LED package for exceptional brightness 0402 industry standard footprint High reliability PCB based Compatible to IR reflow soldering Miniaturized color effects Waterclear lens Applications LED Front panel indicator Navigation systems Cellphone display Display for industrial control systems Traffic display LCD backlighting for LCD, push button, symbol and keypad Details see: www.we-online.com/catalog/WL-SMCC Updated by Ella 2022-06-20 2022 (C) Wurth Elektronik; CHIP-TECHNOLOGY: AlInGaP; DATASHEET-URL: https://www.we-online.com/redexpert/spec/150040RS73240?ae; DOMINANT-WAVELENGTH: 625nm; EMITTING-COLOR: Red; FORWARD-VOLTAGE: 2V; LUMINOUS-INTENSITY: 100mcd; MOUNT: SMT; PART-NUMBER: 150040RS73240; PEAK-WAVELENGTH: 630nm; VIEWING-ANGLE: 120°
D2 = Diode:SBR3U20SA-13; HEIGHT: 2,3mm; MANUFACTURER: Diodes Inc; NR: SBR3U20SA-13; PACK: SMD
D3 = Eagle_WE-TVS (rev22a):WE-TVS_DFN1610-2L_824032815: WE-TVS TVS Diode – Standard Series Characteristics Fast turn-on Low clamping voltage High ESD withstand voltage Uni- or bidirectional protection Small package Epoxy flame resistant UL94 V-0 Applications DC power supply USB Power Delivery (PD) Headsets and accessories PDAs Digital cameras MP3-Player Touch Panels Notebooks ESD, EFT and Surge Protection ESD protection in accordance with EN 61000-4-2 – 8 kV contact discharge – 15 kV air discharge Details see: https://www.we-online.com/catalog/en/WE-TVS Updated by Ella Wu 2019-07-12 2019 (C) Wurth Elektronik; C-CH: 140pF; CHANNELS: 1; DATASHEET-URL: https://www.we-online.com/catalog/datasheet/824032815.pdf; IPEAK: 100A; MOUNT: SMT; PART-NUMBER: 824032815; VBR: 6V
F1 F2 = Fuse:ERB-RD2R00X; HEIGHT: 1mm; MANUFACTURER: Bourns; NR: MF-ASML050/6-2; PACK: 0402
JP1 JP2 = pinhead:PINHD-1X1: PIN HEADER
L1 L2 = rcl-WE:L: Spule; HEIGHT: 0.5mm; MANUFACTURER: Würth Elektronik; NR: 7427927311; PACK: 0402
LED1-LED105 = IC_LED:1312020030000; HEIGHT: 0,9mm; MANUFACTURER: Würth Elektronik; NR: 1312020030000; PACK: SMD
MS1 = adafruit_feather_long:FEATHERWING
R1 R2 = rcl-WE:R; HEIGHT: 0.35mm; HERSTELLER: Yageo; NR: RC0402FR-075K1L; PACK: 0402; TOL: 1%
R3 R10 = WRIS-RSKS_Rev23a:WRIS-RSKS_0603: WRIS-RSKS Thick Film Resistors Characteristics Mounting style: SMT-Chip Resistance range: 1 Ω - 10 MΩ Resistance tolerance: ±1 %; ±5 % Rated Power: 0.1 - 0.5 W TCR: ±100; ±200; -200~+400 ppm/℃ Sulfur resistant: Tested according to ASTM-B-809 Long term reliability Operating Temperature: -55 °C up to +155 °C Size: 0402 / 0603 / 0805 / 1206 / 1210 Applications Industrial applications IT and communication applications Power Supply and industrial controls Applications in environments with increased sulfur contamination Details see: www.we-online.com/components/products/WRIS-RSKS Created by Ella Wu 2023-12-07 2023 (C) Wurth Elektronik; DATASHEET-URL: https://www.we-online.com/redexpert/spec/560112116001?ae; HEIGHT: 0.45mm; LENGTH: 1.6mm; MOUNT: SMT; PART-NUMBER: 560112116001; RATED-POWE: 0.1W; SIZE: 0603; VALUE: 0Ohm; WIDTH: 0.8mm
R4 R8 = WRIS-RSKS_Rev23a:WRIS-RSKS_0402: WRIS-RSKS Thick Film Resistors Characteristics Mounting style: SMT-Chip Resistance range: 1 Ω - 10 MΩ Resistance tolerance: ±1 %; ±5 % Rated Power: 0.1 - 0.5 W TCR: ±100; ±200; -200~+400 ppm/℃ Sulfur resistant: Tested according to ASTM-B-809 Long term reliability Operating Temperature: -55 °C up to +155 °C Size: 0402 / 0603 / 0805 / 1206 / 1210 Applications Industrial applications IT and communication applications Power Supply and industrial controls Applications in environments with increased sulfur contamination Details see: www.we-online.com/components/products/WRIS-RSKS Created by Ella Wu 2023-12-07 2023 (C) Wurth Elektronik; DATASHEET-URL: https://www.we-online.com/redexpert/spec/560112110001?ae; HEIGHT: 0.35mm; LENGTH: 1mm; MOUNT: SMT; PART-NUMBER: 560112110001; RATED-POWE: 0.0625W; SIZE: 0402; VALUE: 0Ohm; WIDTH: 0.5mm
R5 R9 = WRIS-RSKS_Rev23a:WRIS-RSKS_0603: WRIS-RSKS Thick Film Resistors Characteristics Mounting style: SMT-Chip Resistance range: 1 Ω - 10 MΩ Resistance tolerance: ±1 %; ±5 % Rated Power: 0.1 - 0.5 W TCR: ±100; ±200; -200~+400 ppm/℃ Sulfur resistant: Tested according to ASTM-B-809 Long term reliability Operating Temperature: -55 °C up to +155 °C Size: 0402 / 0603 / 0805 / 1206 / 1210 Applications Industrial applications IT and communication applications Power Supply and industrial controls Applications in environments with increased sulfur contamination Details see: www.we-online.com/components/products/WRIS-RSKS Created by Ella Wu 2023-12-07 2023 (C) Wurth Elektronik; DATASHEET-URL: https://www.we-online.com/redexpert/spec/560112116001?ae; HEIGHT: 0.45mm; LENGTH: 1.6mm; MOUNT: SMT; PART-NUMBER: 560112116001; RATED-POWE: 0.1W; SIZE: 0603; WIDTH: 0.8mm
R6 = WRIS-RSKS_Rev23a:WRIS-RSKS_0402: WRIS-RSKS Thick Film Resistors Characteristics Mounting style: SMT-Chip Resistance range: 1 Ω - 10 MΩ Resistance tolerance: ±1 %; ±5 % Rated Power: 0.1 - 0.5 W TCR: ±100; ±200; -200~+400 ppm/℃ Sulfur resistant: Tested according to ASTM-B-809 Long term reliability Operating Temperature: -55 °C up to +155 °C Size: 0402 / 0603 / 0805 / 1206 / 1210 Applications Industrial applications IT and communication applications Power Supply and industrial controls Applications in environments with increased sulfur contamination Details see: www.we-online.com/components/products/WRIS-RSKS Created by Ella Wu 2023-12-07 2023 (C) Wurth Elektronik; DATASHEET-URL: https://www.we-online.com/redexpert/spec/560112110245?ae; HEIGHT: 0.35mm; LENGTH: 1mm; MOUNT: SMT; PART-NUMBER: 560112110245; RATED-POWE: 0.1W; SIZE: 0402; VE: 50V; WIDTH: 0.5mm
R7 = WRIS-RSKS_Rev23a:WRIS-RSKS_0402: WRIS-RSKS Thick Film Resistors Characteristics Mounting style: SMT-Chip Resistance range: 1 Ω - 10 MΩ Resistance tolerance: ±1 %; ±5 % Rated Power: 0.1 - 0.5 W TCR: ±100; ±200; -200~+400 ppm/℃ Sulfur resistant: Tested according to ASTM-B-809 Long term reliability Operating Temperature: -55 °C up to +155 °C Size: 0402 / 0603 / 0805 / 1206 / 1210 Applications Industrial applications IT and communication applications Power Supply and industrial controls Applications in environments with increased sulfur contamination Details see: www.we-online.com/components/products/WRIS-RSKS Created by Ella Wu 2023-12-07 2023 (C) Wurth Elektronik; DATASHEET-URL: https://www.we-online.com/redexpert/spec/560112110092?ae; HEIGHT: 0.35mm; LENGTH: 1mm; MOUNT: SMT; PART-NUMBER: 560112110092; RATED-POWE: 0.1W; SIZE: 0402; VE: 50V; WIDTH: 0.5mm
S1 S2 = 434331013822:434331013822_ANGEPASST; HEIGHT: 1.35mm; MANUFACTURER: Würth Elektronik; NR: 434331013822
ST1 ST2 = testpads:1_5X1MM
U$1 = TI:TXS0101DCK; HEIGHT: 1mm; MANUFACTURER: Texas Instruments; NR: TXS0101DCK; PACK: SC-70 SMD

## Net classes
0 default: width 0.15 mm, drill 0.2 mm, clearance 0.15 mm
1 VCC: width 0.2 mm, drill 0.2 mm, clearance 0.2 mm to class 0, clearance 0.2 mm
4 VDDIO: width 0.2 mm, drill 0.2 mm, clearance 0.2 mm to class 0, clearance 0.2 mm to class 1, clearance 0.2 mm to class 2, clearance 0.2 mm to class 3, clearance 0.2 mm

## Board
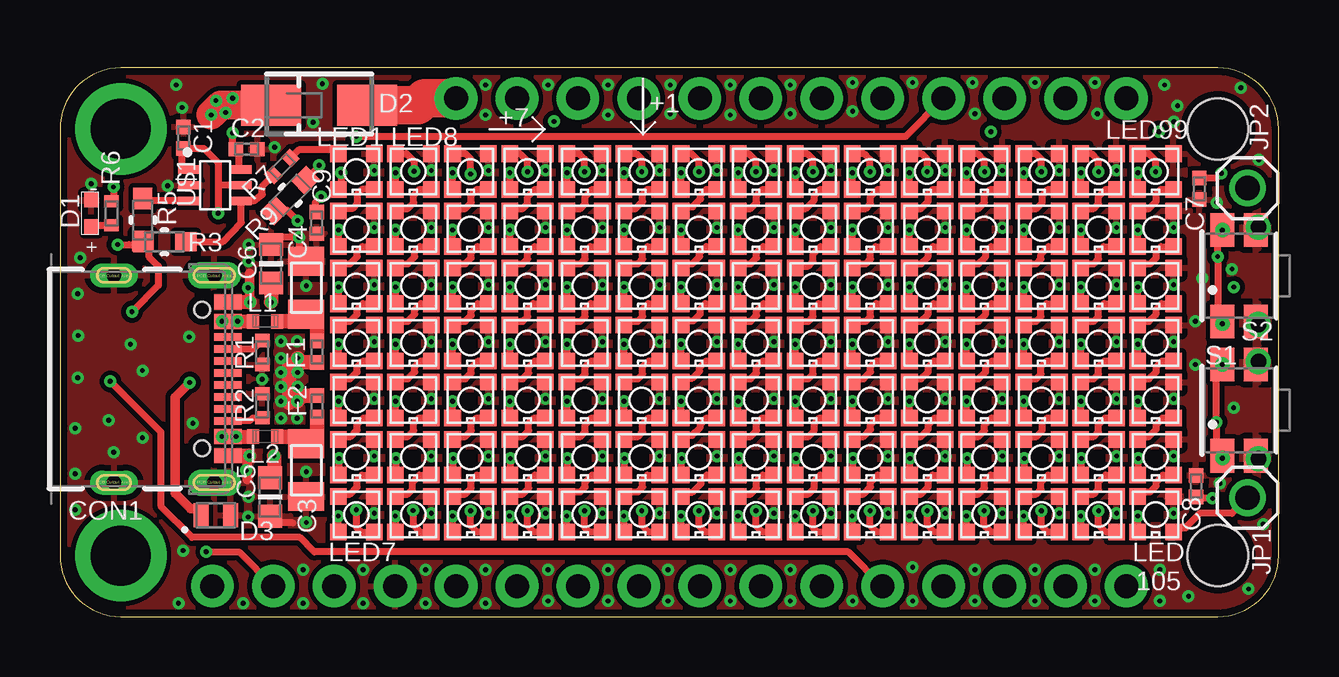
[diagram p7: board, top side]
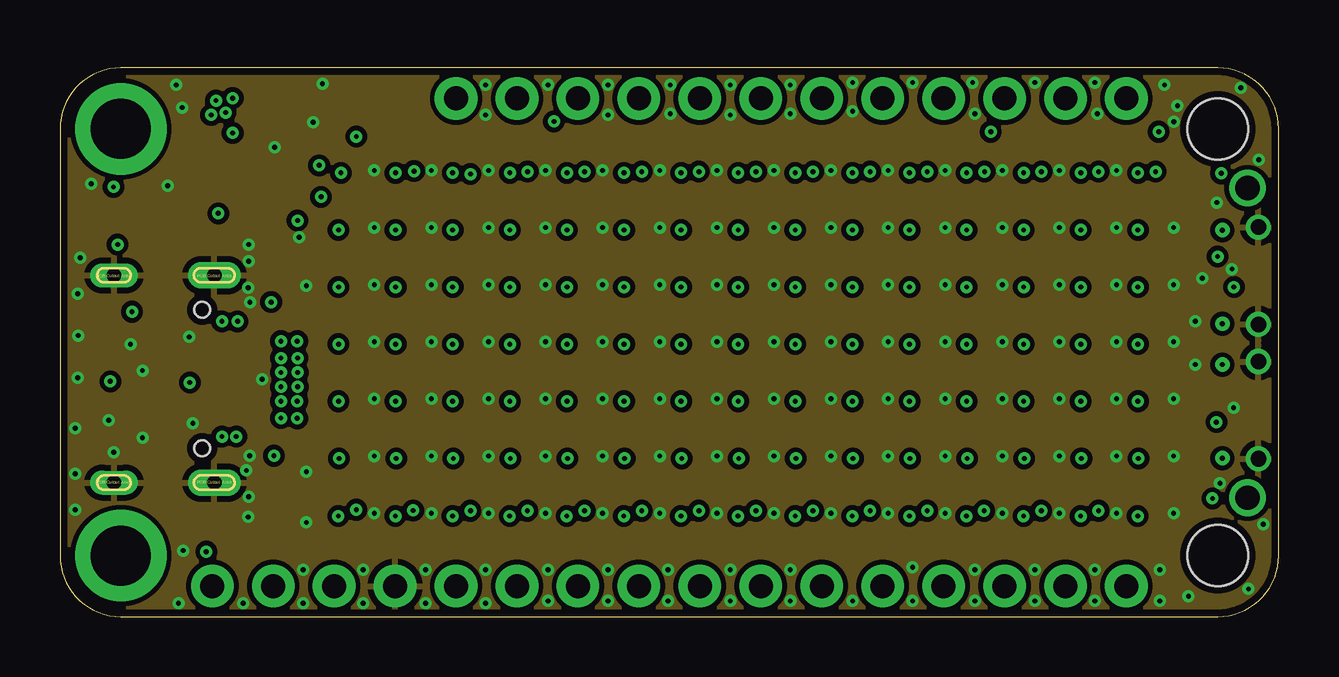
[diagram p8: board, inner layer Route2]
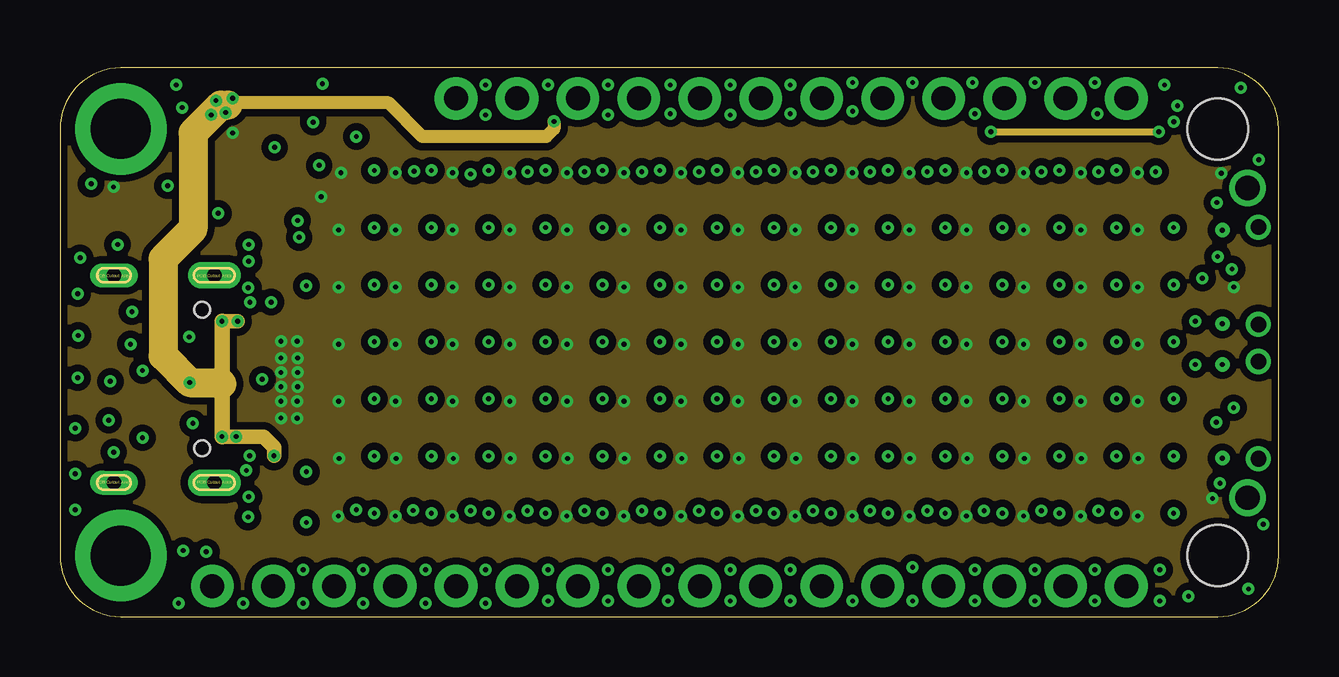
[diagram p9: board, inner layer Route15]
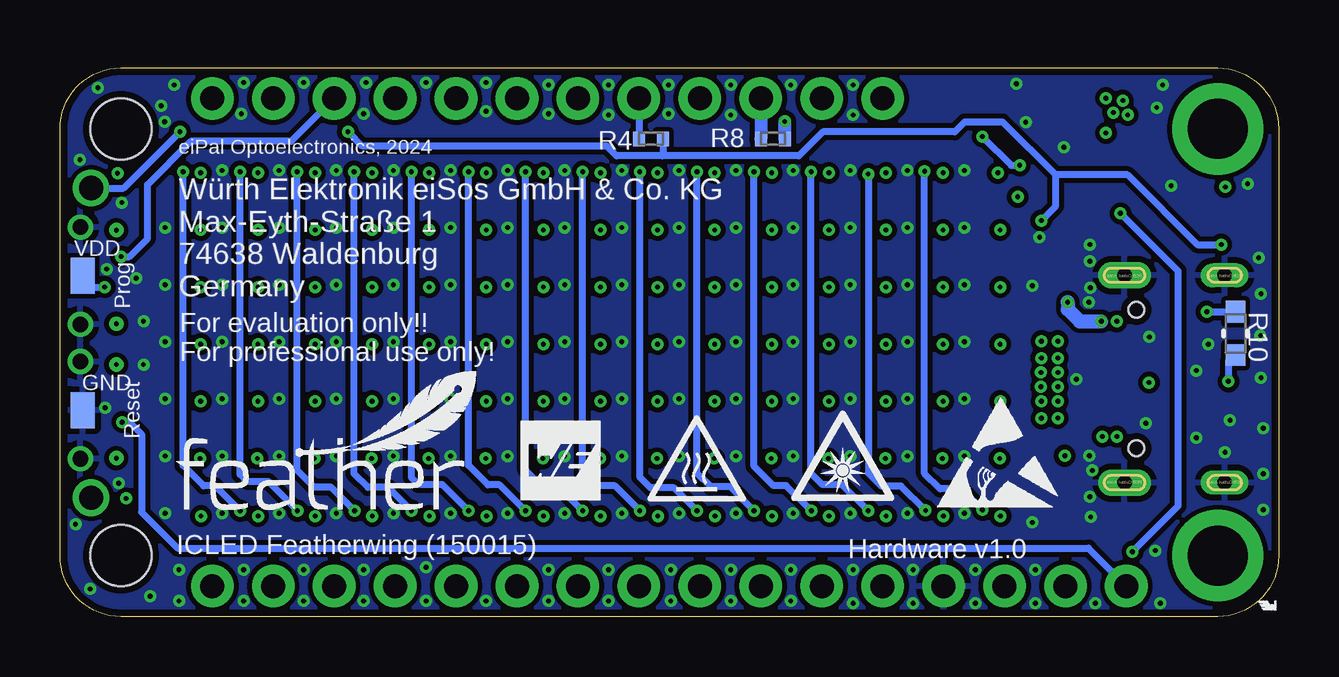
[diagram p10: board, bottom side, seen from below]

Size 50.8 x 22.86 mm. Coordinates in mm from the lower left corner, seen from the top.
Copper layers (1*2+15*16): Top 0.035mm / dielectric 0.41mm / Route2 0.035mm / dielectric 0.71mm / Route15 0.035mm / dielectric 0.41mm / Bottom 0.035mm
Design rules "default *": minimum track width 0.2mm, minimum drill 0.2mm, track to track 0.2mm, track to pad 0.2mm, pad to pad 0.2mm, via to via 0.2mm, smd to smd 0.2mm, copper to edge 0.3mm, drill to drill 0.3mm, minimum pad ring 0.2mm, minimum via ring 0.15mm, stop-mask expansion 0.05mm, vias tented up to drill 0.7mm, thermal gap 10mil
tKeepout: area 15.6,20.3 to 45.7,22.8; area 4.9,0.1 to 35,2.6; area 35,0.1 to 45.8,2.6
tRestrict: area 12.1,18.3 to 12.6,18.8; area 12.2,18.9 to 12.5,19.6; area 14.5,15.9 to 15,16.4; area 12.1,15.9 to 12.6,16.4; area 12.1,13.5 to 12.6,14; area 14.5,13.5 to 15,14; area 16.9,13.5 to 17.4,14; area 19.2,13.5 to 19.7,14; area 21.6,13.5 to 22.1,14; area 24,13.5 to 24.5,14; area 26.4,13.5 to 26.9,14; area 26.4,13.5 to 26.9,14; 67 more areas

### Footprints (pad centres in the part's own frame; a part is rotated, then mirrored left to right if it is on the bottom)
C0402_IPC = smd 0.6 x 0.6: 1 -0.45,0; 2 0.45,0
C0805 = smd 1.2 x 1.5: P$1 -1.1,0; P$2 1.1,0
C0603_IPC = smd 0.95 x 1: 1 -0.8,0; 2 0.8,0
629722000214 = smd 0.3 x 1.15: A1 -3.35,4.745; A4 -2.55,4.745; A5 -1.25,4.745; A6 -0.25,4.745; A7 0.25,4.745; A8 1.25,4.745; A9 2.55,4.745; A12 3.35,4.745; B1 3.05,4.745; B4 2.25,4.745; B5 1.75,4.745; B6 0.75,4.745; B7 -0.75,4.745; B8 -1.75,4.745; B9 -2.25,4.745; B12 -3.05,4.745 | drill 0.6 pad 1.1 long: P$1 -4.32,4.18; P$2 4.32,4.18 | drill 0.6 pad 1 long: P$3 -4.32,0; P$4 4.32,0 | hole 0.65: -2.89,3.68; 2.89,3.68
WL-SMCC_0402 = smd 0.6 x 0.6: 1 -0.55,0; 2 0.55,0
SBR3U20SA = smd 2.5 x 1.7: A 2,0; K -2,0
WE-TVS_DFN1610-2L = smd 0.625 x 1: 1 -0.613,0; 2 0.613,0
0402 = smd 0.6 x 0.6: 1 -0.45,0; 2 0.45,0
1X01/R = drill 1.016: 1 0,0
L0402_WE_FERRIT = smd 0.5 x 0.6: P$1 -0.5,0; P$2 0.5,0
1312020030000_FWANGEPASST = smd 0.69 x 0.69: 1-DOUT -0.745,-0.745; 2-VDD -0.745,0.745; 3-DIN 0.745,0.745; 4-GND 0.745,-0.745
FEATHERWING = drill 1 pad 1.778: 1 6.35,1.27; 2 8.89,1.27; 3 11.43,1.27; 4 13.97,1.27; 5 16.51,1.27; 6 19.05,1.27; 7 21.59,1.27; 8 24.13,1.27; 9 26.67,1.27; 10 29.21,1.27; 11 31.75,1.27; 12 34.29,1.27; 13 36.83,1.27; 14 39.37,1.27; 15 41.91,1.27; 16 44.45,1.27; 17 44.45,21.59; 18 41.91,21.59; 19 39.37,21.59; 20 36.83,21.59; 21 34.29,21.59; 22 31.75,21.59; 23 29.21,21.59; 24 26.67,21.59; 25 24.13,21.59; 26 21.59,21.59; 27 19.05,21.59; 28 16.51,21.59 | drill 2.5 pad 3.81: P$1 2.54,20.32; P$2 2.54,2.54 | hole 2.54: 48.26,20.32; 48.26,2.54
R0402_IPC = smd 0.55 x 0.6: 1 -0.5,0; 2 0.5,0
WRIS-RSKS_0603_WAVE = smd 0.9 x 0.8: 1 -0.9,0; 2 0.9,0
WRIS-RSKS_0402 = smd 0.5 x 0.6: 1 -0.5,0; 2 0.5,0
434331013822_ICLEDFW_ANGEPASST = smd 1.4 x 1: 1 -1.9,0.7; 2 1.9,0.7; 3 1.9,-0.7; 4 -1.9,-0.7 | drill 0.65 pad 0.78: 5 -2.025,-0.8; 6 2.025,-0.8 | drill 0.2 pad 0.5: 7 -2,0.7; 8 1.9,0.7
1_5X1MM = smd 1 x 1.5 bottom: 1 0,0
SC70 = smd 0.35 x 0.85: 1 -0.65,-1.1; 2 0,-1.1; 3 0.65,-1.1; 4 0.65,1.1; 5 0,1.1; 6 -0.65,1.1

### Placement (x,y rotation side)
C1  5.15,19.95 270 top
C2  7.78,19.47 180 top
C3  10.27,6.1 270 top
C4  10.27,13.7 90 top
C5  8.75,4.98 270 top
C6  8.8,14.7 90 top
C7  47.49,17.82 270 top
C8  47.35,5.43 90 top
C9  10.7,16.4 270 top
CON1  2.25,9.9 270 top
D1  1.31,16.8 270 top
D2  10.81,21.31 0 top
D3  6.5,4.22 0 top
F1  10.72,11.04 270 top
F2  10.72,8.76 90 top
JP1  49.5,4.95 0 top
JP2  49.5,17.85 0 top
L1  8.56,12.3 180 top
L2  8.56,7.5 180 top
LED1  12.35,18.54 90 top
LED2  12.35,16.16 90 top
LED3  12.35,13.78 90 top
LED4  12.35,11.4 90 top
LED5  12.35,9.02 90 top
LED6  12.35,6.64 90 top
LED7  12.35,4.26 90 top
LED8  14.73,18.54 90 top
LED9  14.73,16.16 90 top
LED10  14.73,13.78 90 top
LED11  14.73,11.4 90 top
LED12  14.73,9.02 90 top
LED13  14.73,6.64 90 top
LED14  14.73,4.26 90 top
LED15  17.11,18.54 90 top
LED16  17.11,16.16 90 top
LED17  17.11,13.78 90 top
LED18  17.11,11.4 90 top
LED19  17.11,9.02 90 top
LED20  17.11,6.64 90 top
LED21  17.11,4.26 90 top
LED22  19.49,18.54 90 top
LED23  19.49,16.16 90 top
LED24  19.49,13.78 90 top
LED25  19.49,11.4 90 top
LED26  19.49,9.02 90 top
LED27  19.49,6.64 90 top
LED28  19.49,4.26 90 top
LED29  21.87,18.54 90 top
LED30  21.87,16.16 90 top
LED31  21.87,13.78 90 top
LED32  21.87,11.4 90 top
LED33  21.87,9.02 90 top
LED34  21.87,6.64 90 top
LED35  21.87,4.26 90 top
LED36  24.25,18.54 90 top
LED37  24.25,16.16 90 top
LED38  24.25,13.78 90 top
LED39  24.25,11.4 90 top
LED40  24.25,9.02 90 top
LED41  24.25,6.64 90 top
LED42  24.25,4.26 90 top
LED43  26.63,18.54 90 top
LED44  26.63,16.16 90 top
LED45  26.63,13.78 90 top
LED46  26.63,11.4 90 top
LED47  26.63,9.02 90 top
LED48  26.63,6.64 90 top
LED49  26.63,4.26 90 top
LED50  29.01,18.54 90 top
LED51  29.01,16.16 90 top
LED52  29.01,13.78 90 top
LED53  29.01,11.4 90 top
LED54  29.01,9.02 90 top
LED55  29.01,6.64 90 top
LED56  29.01,4.26 90 top
LED57  31.39,18.54 90 top
LED58  31.39,16.16 90 top
LED59  31.39,13.78 90 top
LED60  31.39,11.4 90 top
LED61  31.39,9.02 90 top
LED62  31.39,6.64 90 top
LED63  31.39,4.26 90 top
LED64  33.77,18.54 90 top
LED65  33.77,16.16 90 top
LED66  33.77,13.78 90 top
LED67  33.77,11.4 90 top
LED68  33.77,9.02 90 top
LED69  33.77,6.64 90 top
LED70  33.77,4.26 90 top
LED71  36.15,18.54 90 top
LED72  36.15,16.16 90 top
LED73  36.15,13.78 90 top
LED74  36.15,11.4 90 top
LED75  36.15,9.02 90 top
LED76  36.15,6.64 90 top
LED77  36.15,4.26 90 top
LED78  38.53,18.54 90 top
LED79  38.53,16.16 90 top
LED80  38.53,13.78 90 top
LED81  38.53,11.4 90 top
LED82  38.53,9.02 90 top
LED83  38.53,6.64 90 top
LED84  38.53,4.26 90 top
LED85  40.91,18.54 90 top
LED86  40.91,16.16 90 top
LED87  40.91,13.78 90 top
LED88  40.91,11.4 90 top
LED89  40.91,9.02 90 top
LED90  40.91,6.64 90 top
LED91  40.91,4.26 90 top
LED92  43.29,18.54 90 top
LED93  43.29,16.16 90 top
LED94  43.29,13.78 90 top
LED95  43.29,11.4 90 top
LED96  43.29,9.02 90 top
LED97  43.29,6.64 90 top
LED98  43.29,4.26 90 top
LED99  45.67,18.54 90 top
LED100  45.67,16.16 90 top
LED101  45.67,13.78 90 top
LED102  45.67,11.4 90 top
LED103  45.67,9.02 90 top
LED104  45.67,6.64 90 top
LED105  45.67,4.26 90 top
MS1  0,0 0 top
R1  8.43,11 90 top
R2  8.43,8.79 90 top
R3  4.35,15.61 180 top
R4  26.17,19.9 0 bottom
R5  3.45,16.52 270 top
R6  2.15,16.8 90 top
R7  9.25,18.75 45 top
R8  21.09,19.9 0 bottom
R9  9.59,17.55 225 top
R10  1.8,11.8 90 bottom
S1  49.15,8.6 90 top
S2  49.15,14.2 90 top
ST1  49.85,14.2 180 top
ST2  49.85,8.6 0 top
U$1  6.46,17.97 270 top
U$2  [OPTICAL_RADIATION]  15.92,4.71 0 top
U$3  [HEAT_DANGER]  22.21,4.8 0 top
U$4  [FEATHER_12MM]  45.97,4.44 0 bottom

### Tracks (layer width: path | path; a pad name or v marks a point on that pad's centre or on a via)
3V3  (via drill 0.2)
  Top 0.3: 6.6,18 6.6,18.9 6,19.5 C1.2 5.1,19.45 5.1,18.6 5.12,18.62 U$1.1 | v6.1,2.7 7.46,2.7 MS1.2 | U$1.5 6.63,17.97 6.6,18 | 6.6,18 v6.6,16.8
  Bottom 0.3: v6.1,2.7 4.2,4.6 4.2,14.4 v6.6,16.8
5VIN  (via drill 0.2)
  Top 0.2: CON1.A4 CON1.B9 | CON1.A9 CON1.B4
  Top 0.3: v6.75,7.5 6.84,7.5 CON1.B4 | v6.75,12.3 6.84,12.3 CON1.B9 | L1.P$2 8,12.3 | 7.4,7.5 L2.P$2 | D3.1 5.8,4.31 5.8,4.5
  Top 0.4: 5.8,4.5 5.44,4.5 4.8,5.14 4.8,9.14 v5.41,9.75
  Top 0.58: v7.35,7.5 7.4,7.5 8,7.5 | v7.4,12.3 8,12.3 | C6.1 v8.8,13.1 | v8.92,6.7 8.92,5.95 C5.1
  Top 1.2: D2.K 6.7,21.31 v6.3,20.91 v6.3,20.9
  Route15 0.3: 6.59,21.31 v6.9,21 6.9,21.3 v7.2,21.6 7.4,21.4 | v6.5,21.5 6.5,21.4 6.59,21.31 | 6.59,21.31 6.7,21.31
  Route15 0.55: 7.4,21.4 13.7,21.4 15.1,20 20.27,20 20.59,20.32 v20.59,20.63
  Route15 0.6: v7.4,12.3 v6.75,12.3 | v6.75,7.5 v7.35,7.5 8.48,7.5 8.92,7.06 v8.92,6.7
  Route15 0.65: v6.75,12.3 6.75,9.7 v6.75,7.5
  Route15 1.2: 6.75,9.7 6.7,9.75 v5.41,9.75 4.3,10.86 4.3,14.9 5.55,16.15 5.55,20.15 v6.3,20.9 | v6.3,20.9 6.71,21.31 | 6.71,21.31 7,21.31 | 6.71,21.31 6.7,21.31 6.7,21.3 v6.3,20.9
  Bottom 0.55: R8.2 v20.59,20.63
  Bottom 0.58: v8.8,13.1 8.8,12.8 8.3,12.3 v7.4,12.3
/RESET  (via drill 0.2)
  Top 0.3: S1.7 S1.1 48.2,6.95 v48.2,8.1 48.2,10.25 S1.8
  Bottom 0.3: MS1.1 7.93,2.85 45.9,2.85 47.4,4.35 47.4,7.6 47.9,8.1 v48.2,8.1
DI  (via drill 0.2)
  Top 0.3: R5.2 R3.2 | 2.88,15.5 v2.4,15.5 3.28,15.5 R5.2 | R5.2 3.7,15.42 3.7,15 4.1,14.6 4.1,13.8 v3,12.7 | R9.2 9.45,16.95 v9.9,16.5
  Route15 0.3: v38.8,20.2 v45.8,20.2
  Bottom 0.3: v2.4,15.5 3.4,15.5 6.3,18.4 9.3,18.4 | v38.8,20.2 38.2,19.6 28,19.6 27.6,19.2 25.7,19.2 | 9.3,18.4 11.5,20.6 13.1,20.6 13.5,20.2 19,20.2 20,19.2 25.7,19.2 | R4.2 25.67,19.23 25.7,19.2 | JP2.1 48.15,17.85 v45.8,20.2 | v3,12.7 1.85,12.7 R10.2 | v9.9,16.5 9.3,17.1 9.3,18.4
DI1
  Top 0.3: 11.52,19.2 LED1.3-DIN 11.44,19.45 9.95,19.45 R7.2
DI2
  Top 0.3: LED1.1-DOUT 12.59,17.8 12.39,17.6 12.39,17.2 12.19,17 11.7,17 LED2.3-DIN
DI3
  Top 0.3: LED3.3-DIN 11.78,14.7 12.09,14.7 12.39,15 12.39,15.2 12.61,15.41 LED2.1-DOUT
DI4
  Top 0.3: LED4.3-DIN 11.76,12.3 12.09,12.3 12.39,12.6 12.39,12.8 12.62,13.04 LED3.1-DOUT
DI5
  Top 0.3: LED5.3-DIN 11.74,9.9 12.09,9.9 12.39,10.2 12.39,10.4 12.64,10.65 LED4.1-DOUT
DI6
  Top 0.3: LED6.3-DIN 11.72,7.5 12.11,7.5 12.39,7.78 12.39,8.01 12.66,8.28 LED5.1-DOUT
DI7
  Top 0.3: LED7.3-DIN 11.7,5.1 12.09,5.1 12.39,5.4 12.39,5.7 12.59,5.89 LED6.1-DOUT
DI8  (via drill 0.2)
  Top 0.3: LED8.3-DIN 14.44,19.29 14.76,18.96 v14.76,18.56 | LED7.1-DOUT 12.56,3.52 12.35,3.73 v12.35,4.45
  Bottom 0.3: v14.76,18.56 14.76,5.96 14.12,5.32 13.22,5.32 v12.35,4.45
DI9
  Top 0.3: LED9.3-DIN 14.08,17 14.49,17 14.74,17.25 14.74,17.55 14.98,17.8 LED8.1-DOUT
DI10
  Top 0.3: LED10.3-DIN 14.16,14.7 14.49,14.7 14.79,15 14.79,15.2 15.01,15.41 LED9.1-DOUT
DI11
  Top 0.3: LED11.3-DIN 14.14,12.3 14.49,12.3 14.79,12.6 14.79,12.78 15.04,13.04 LED10.1-DOUT
DI12
  Top 0.3: LED12.3-DIN 14.12,9.9 14.49,9.9 14.79,10.2 14.79,10.4 15.04,10.65 LED11.1-DOUT
DI13
  Top 0.3: LED13.3-DIN 14.1,7.5 14.49,7.5 14.74,7.75 14.74,8.05 14.96,8.28 LED12.1-DOUT
DI14
  Top 0.3: LED14.3-DIN 14.08,5.1 14.49,5.1 14.69,5.3 14.69,5.6 14.98,5.89 LED13.1-DOUT
DI15  (via drill 0.2)
  Top 0.3: v17.11,18.44 17.11,19.08 16.9,19.29 LED15.3-DIN | v14.72,4.42 14.72,3.82 15.03,3.51 LED14.1-DOUT
  Bottom 0.3: v17.11,18.44 17.11,5.98 16.57,5.44 15.74,5.44 v14.72,4.42
DI16
  Top 0.3: LED16.3-DIN 16.46,17 16.89,17 17.14,17.25 17.14,17.55 17.39,17.8 LED15.1-DOUT
DI17
  Top 0.3: LED17.3-DIN 16.54,14.7 16.89,14.7 17.14,14.95 17.14,15.15 17.41,15.41 LED16.1-DOUT
DI18
  Top 0.3: LED18.3-DIN 16.52,12.3 16.89,12.3 17.14,12.55 17.14,12.75 17.43,13.04 LED17.1-DOUT
DI19
  Top 0.3: LED19.3-DIN 16.5,9.9 16.89,9.9 17.14,10.15 17.14,10.37 17.43,10.65 LED18.1-DOUT
DI20
  Top 0.3: LED20.3-DIN 16.48,7.5 16.89,7.5 17.14,7.75 17.14,8.05 17.36,8.28 LED19.1-DOUT
DI21
  Top 0.3: LED21.3-DIN 16.46,5.1 16.89,5.1 17.14,5.35 17.14,5.65 17.39,5.89 LED20.1-DOUT
DI22  (via drill 0.2)
  Top 0.3: LED21.1-DOUT 17.39,3.52 17.11,3.8 v17.11,4.41 | v19.49,18.54 19.49,18.97 19.17,19.29 LED22.3-DIN
  Bottom 0.3: v17.11,4.41 18.2,5.5 19.02,5.5 19.49,5.97 v19.49,18.54
DI23
  Top 0.3: LED23.3-DIN 18.84,17 19.29,17 19.49,17.2 19.49,17.49 19.79,17.8 LED22.1-DOUT
DI24
  Top 0.3: LED24.3-DIN 18.92,14.7 19.29,14.7 19.49,14.9 19.49,15.12 19.78,15.41 LED23.1-DOUT
DI25
  Top 0.3: LED25.3-DIN 18.9,12.3 19.29,12.3 19.49,12.5 19.49,12.8 19.73,13.04 LED24.1-DOUT
DI26
  Top 0.3: LED26.3-DIN 18.88,9.9 19.29,9.9 19.54,10.15 19.54,10.4 19.8,10.65 LED25.1-DOUT
DI27
  Top 0.3: LED27.3-DIN 18.86,7.5 19.29,7.5 19.54,7.75 19.54,8.05 19.77,8.28 LED26.1-DOUT
DI28
  Top 0.3: LED28.3-DIN 18.84,5.1 19.29,5.1 19.54,5.35 19.54,5.65 19.79,5.89 LED27.1-DOUT
DI29  (via drill 0.2)
  Top 0.3: LED28.1-DOUT 19.75,3.52 19.48,3.79 v19.48,4.41 | v21.87,18.54 21.87,19.06 21.64,19.29 LED29.3-DIN
  Bottom 0.3: v21.87,18.54 21.87,6.26 21.07,5.46 20.53,5.46 v19.48,4.41
DI30
  Top 0.3: LED30.3-DIN 21.22,17 21.69,17 21.89,17.2 21.89,17.5 22.18,17.8 LED29.1-DOUT
DI31
  Top 0.3: LED31.3-DIN 21.3,14.7 21.69,14.7 21.89,14.9 21.89,15.2 22.11,15.41 LED30.1-DOUT
DI32
  Top 0.3: LED32.3-DIN 21.28,12.3 21.69,12.3 21.89,12.5 21.89,12.8 22.12,13.04 LED31.1-DOUT
DI33
  Top 0.3: LED33.3-DIN 21.26,9.9 21.69,9.9 21.89,10.1 21.89,10.4 22.14,10.65 LED32.1-DOUT
DI34
  Top 0.3: LED34.3-DIN 21.24,7.5 21.69,7.5 21.89,7.7 21.89,8 22.16,8.28 LED33.1-DOUT
DI35
  Top 0.3: LED35.3-DIN 21.32,5.2 21.69,5.2 21.89,5.4 21.89,5.6 22.18,5.89 LED34.1-DOUT
DI36  (via drill 0.2)
  Top 0.3: LED35.1-DOUT 22.07,3.52 21.87,3.72 v21.87,4.41 | v24.25,18.54 24.25,19.06 24.03,19.28 LED36.3-DIN
  Bottom 0.3: v24.25,18.54 24.25,5.98 23.67,5.4 22.86,5.4 v21.87,4.41
DI37
  Top 0.3: LED37.3-DIN 23.6,17 23.99,17 24.29,17.3 24.29,17.6 24.48,17.8 LED36.1-DOUT
DI38
  Top 0.3: LED38.3-DIN 23.68,14.7 24.09,14.7 24.29,14.9 24.29,15.2 24.5,15.41 LED37.1-DOUT
DI39
  Top 0.3: LED39.3-DIN 23.66,12.3 24.09,12.3 24.29,12.5 24.29,12.8 24.52,13.04 LED38.1-DOUT
DI40
  Top 0.3: LED40.3-DIN 23.64,9.9 24.09,9.9 24.29,10.1 24.29,10.4 24.55,10.65 LED39.1-DOUT
DI41
  Top 0.3: LED41.3-DIN 23.62,7.5 24.09,7.5 24.29,7.7 24.29,8.02 24.54,8.28 LED40.1-DOUT
DI42
  Top 0.3: LED42.3-DIN 23.7,5.2 24.09,5.2 24.29,5.4 24.29,5.7 24.48,5.89 LED41.1-DOUT
DI43  (via drill 0.2)
  Top 0.3: LED42.1-DOUT 24.54,3.52 24.25,3.8 v24.25,4.41 | v26.63,18.54 26.63,18.98 26.32,19.29 LED43.3-DIN
  Bottom 0.3: v26.63,18.54 26.63,5.81 26.18,5.36 25.2,5.36 v24.25,4.41
DI44
  Top 0.3: LED44.3-DIN 26.05,17.07 26.37,17.07 26.7,17.4 26.7,17.55 26.95,17.8 LED43.1-DOUT
DI45
  Top 0.3: LED45.3-DIN 26.06,14.7 26.36,14.7 26.66,15 26.66,15.14 26.93,15.41 LED44.1-DOUT
DI46
  Top 0.3: LED46.3-DIN 26.06,12.32 26.4,12.32 26.69,12.61 26.69,12.82 26.91,13.04 LED45.1-DOUT
DI47
  Top 0.3: LED47.3-DIN 26.05,9.93 26.36,9.93 26.66,10.23 26.66,10.37 26.95,10.65 LED46.1-DOUT
DI48
  Top 0.3: LED48.3-DIN 26.05,7.55 26.35,7.55 26.69,7.89 26.69,8.01 26.95,8.28 LED47.1-DOUT
DI49
  Top 0.3: LED49.3-DIN 26.06,5.18 26.36,5.18 26.72,5.54 26.72,5.66 26.95,5.89 LED48.1-DOUT
DI50  (via drill 0.2)
  Top 0.3: LED49.1-DOUT 26.91,3.52 26.63,3.79 v26.63,4.41 | v29.01,18.54 29.01,18.99 28.72,19.28 LED50.3-DIN
  Bottom 0.3: v29.01,18.54 29.01,5.86 28.6,5.45 27.67,5.45 v26.63,4.41
DI51
  Top 0.3: LED51.3-DIN 28.36,17 28.79,17 29.04,17.25 29.04,17.55 29.29,17.8 LED50.1-DOUT
DI52
  Top 0.3: LED52.3-DIN 28.44,14.7 28.79,14.7 29.04,14.95 29.04,15.15 29.3,15.41 LED51.1-DOUT
DI53
  Top 0.3: LED53.3-DIN 28.42,12.3 28.79,12.3 29.04,12.55 29.04,12.75 29.32,13.04 LED52.1-DOUT
DI54
  Top 0.3: LED54.3-DIN 28.4,9.9 28.79,9.9 29.04,10.15 29.04,10.39 29.31,10.65 LED53.1-DOUT
DI55
  Top 0.3: LED55.3-DIN 28.38,7.5 28.79,7.5 29.04,7.75 29.04,8.05 29.27,8.28 LED54.1-DOUT
DI56
  Top 0.3: LED56.3-DIN 28.36,5.1 28.79,5.1 29.04,5.35 29.04,5.65 29.29,5.89 LED55.1-DOUT
DI57  (via drill 0.2)
  Top 0.3: LED56.1-DOUT 29.29,3.52 29.01,3.79 v29.01,4.41 | v31.39,18.54 31.39,19.05 31.16,19.28 LED57.3-DIN
  Bottom 0.3: v31.39,18.54 31.39,6.1 30.75,5.46 30.06,5.46 v29.01,4.41
DI58
  Top 0.3: LED58.3-DIN 30.74,17 31.09,17 31.44,17.35 31.44,17.55 31.68,17.8 LED57.1-DOUT
DI59
  Top 0.3: LED59.3-DIN 30.72,14.6 31.19,14.6 31.39,14.8 31.39,15.1 31.7,15.41 LED58.1-DOUT
DI60
  Top 0.3: LED60.3-DIN 30.8,12.3 31.19,12.3 31.39,12.5 31.39,12.8 31.62,13.04 LED59.1-DOUT
DI61
  Top 0.3: LED61.3-DIN 30.78,9.9 31.19,9.9 31.39,10.1 31.39,10.4 31.64,10.65 LED60.1-DOUT
DI62
  Top 0.3: LED62.3-DIN 30.76,7.5 31.19,7.5 31.44,7.75 31.44,8.05 31.66,8.28 LED61.1-DOUT
DI63
  Top 0.3: LED63.3-DIN 30.74,5.1 31.19,5.1 31.44,5.35 31.44,5.65 31.68,5.89 LED62.1-DOUT
DI64  (via drill 0.2)
  Top 0.3: LED63.1-DOUT 31.57,3.52 31.39,3.7 v31.39,4.41 | v33.77,18.54 33.77,19.04 33.53,19.28 LED64.3-DIN
  Bottom 0.3: v33.77,18.54 33.77,6.3 32.96,5.49 32.47,5.49 v31.39,4.41
DI65
  Top 0.3: LED65.3-DIN 33.12,17 33.59,17 33.79,17.2 33.79,17.5 34.09,17.8 LED64.1-DOUT
DI66
  Top 0.3: LED66.3-DIN 33.2,14.7 33.59,14.7 33.79,14.9 33.79,15.2 34.01,15.41 LED65.1-DOUT
DI67
  Top 0.3: LED67.3-DIN 33.18,12.3 33.59,12.3 33.79,12.5 33.79,12.8 34.02,13.04 LED66.1-DOUT
DI68
  Top 0.3: LED68.3-DIN 33.16,9.9 33.49,9.9 33.79,10.2 33.79,10.4 34.05,10.65 LED67.1-DOUT
DI69
  Top 0.3: LED69.3-DIN 33.14,7.5 33.49,7.5 33.79,7.8 33.79,8 34.06,8.28 LED68.1-DOUT
DI70
  Top 0.3: LED70.3-DIN 33.12,5.1 33.49,5.1 33.79,5.4 33.79,5.6 34.09,5.89 LED69.1-DOUT
DI71  (via drill 0.2)
  Top 0.3: LED70.1-DOUT 34.05,3.52 33.77,3.8 v33.77,4.41 | v36.15,18.54 36.15,19.05 35.92,19.28 LED71.3-DIN
  Bottom 0.3: v36.15,18.54 36.15,5.79 35.86,5.5 34.86,5.5 v33.77,4.41
DI72
  Top 0.3: LED72.3-DIN 35.5,17 35.89,17 36.19,17.3 36.19,17.6 36.38,17.8 LED71.1-DOUT
DI73
  Top 0.3: LED73.3-DIN 35.58,14.7 35.89,14.7 36.19,15 36.19,15.2 36.41,15.41 LED72.1-DOUT
DI74
  Top 0.3: LED74.3-DIN 35.56,12.3 35.89,12.3 36.19,12.6 36.19,12.8 36.42,13.04 LED73.1-DOUT
DI75
  Top 0.3: LED75.3-DIN 35.54,9.9 35.89,9.9 36.19,10.2 36.19,10.4 36.45,10.65 LED74.1-DOUT
DI76
  Top 0.3: LED76.3-DIN 35.52,7.5 35.89,7.5 36.19,7.8 36.19,8 36.47,8.28 LED75.1-DOUT
DI77
  Top 0.3: LED77.3-DIN 35.5,5.1 35.89,5.1 36.19,5.4 36.19,5.7 36.38,5.89 LED76.1-DOUT
DI78  (via drill 0.2)
  Top 0.3: LED77.1-DOUT 36.45,3.52 36.15,3.82 v36.15,4.41 | v38.54,18.54 38.54,19 38.26,19.28 LED78.3-DIN
  Bottom 0.3: v38.54,18.54 38.54,5.96 37.96,5.38 37.12,5.38 v36.15,4.41
DI79
  Top 0.3: LED79.3-DIN 37.88,17 38.29,17 38.54,17.25 38.54,17.55 38.78,17.8 LED78.1-DOUT
DI80
  Top 0.3: LED80.3-DIN 37.96,14.7 38.29,14.7 38.59,15 38.59,15.2 38.8,15.41 LED79.1-DOUT
DI81
  Top 0.3: LED81.3-DIN 37.94,12.3 38.29,12.3 38.59,12.6 38.59,12.8 38.83,13.04 LED80.1-DOUT
DI82
  Top 0.3: LED82.3-DIN 37.92,9.9 38.29,9.9 38.59,10.2 38.59,10.4 38.84,10.65 LED81.1-DOUT
DI83
  Top 0.3: LED83.3-DIN 37.9,7.5 38.29,7.5 38.54,7.75 38.54,7.98 38.84,8.28 LED82.1-DOUT
DI84
  Top 0.3: LED84.3-DIN 37.88,5.1 38.29,5.1 38.54,5.35 38.54,5.65 38.78,5.89 LED83.1-DOUT
DI85  (via drill 0.2)
  Top 0.3: LED84.1-DOUT 38.81,3.52 38.52,3.81 v38.52,4.41 | v40.91,18.54 40.91,19.05 40.68,19.28 LED85.3-DIN
  Bottom 0.3: v40.91,18.54 40.91,6.1 40.2,5.39 39.5,5.39 v38.52,4.41
DI86
  Top 0.3: LED86.3-DIN 40.26,17 40.69,17 40.94,17.25 40.94,17.55 41.19,17.8 LED85.1-DOUT
DI87
  Top 0.3: LED87.3-DIN 40.34,14.7 40.69,14.7 40.89,14.9 40.89,15.1 41.2,15.41 LED86.1-DOUT
DI88
  Top 0.3: LED88.3-DIN 40.32,12.3 40.69,12.3 40.89,12.5 40.89,12.8 41.12,13.04 LED87.1-DOUT
DI89
  Top 0.3: LED89.3-DIN 40.3,9.9 40.69,9.9 40.89,10.1 40.89,10.4 41.15,10.65 LED88.1-DOUT
DI90
  Top 0.3: LED90.3-DIN 40.28,7.5 40.69,7.5 40.94,7.75 40.94,8.05 41.16,8.28 LED89.1-DOUT
DI91
  Top 0.3: LED91.3-DIN 40.26,5.1 40.69,5.1 40.89,5.3 40.89,5.6 41.19,5.89 LED90.1-DOUT
DI92  (via drill 0.2)
  Top 0.3: LED91.1-DOUT 41.17,3.52 40.9,3.79 v40.9,4.41 | v43.29,18.54 43.29,18.99 43,19.28 LED92.3-DIN
  Bottom 0.3: v43.29,18.54 43.29,5.92 42.99,5.62 42.11,5.62 v40.9,4.41
DI93
  Top 0.3: LED93.3-DIN 42.64,17 43.09,17 43.29,17.2 43.29,17.5 43.59,17.8 LED92.1-DOUT
DI94
  Top 0.3: LED94.3-DIN 42.72,14.7 43.09,14.7 43.29,14.9 43.29,15.2 43.51,15.41 LED93.1-DOUT
DI95
  Top 0.3: LED95.3-DIN 42.7,12.3 43.09,12.3 43.29,12.5 43.29,12.8 43.52,13.04 LED94.1-DOUT
DI96
  Top 0.3: LED96.3-DIN 42.68,9.9 43.09,9.9 43.29,10.1 43.29,10.4 43.55,10.65 LED95.1-DOUT
DI97
  Top 0.3: LED97.3-DIN 42.66,7.5 43.09,7.5 43.29,7.7 43.29,8 43.56,8.28 LED96.1-DOUT
DI98
  Top 0.3: LED98.3-DIN 42.64,5.1 43.09,5.1 43.29,5.3 43.29,5.6 43.59,5.89 LED97.1-DOUT
DI99  (via drill 0.2)
  Top 0.3: LED98.1-DOUT 43.59,3.52 43.29,3.82 v43.29,4.41 | v45.67,18.54 45.67,19 45.38,19.29 LED99.3-DIN
  Bottom 0.3: v45.67,18.54 45.67,6.3 44.82,5.45 44.33,5.45 v43.29,4.41
DI100
  Top 0.3: LED100.3-DIN 45.02,17 45.39,17 45.69,17.3 45.69,17.6 45.88,17.8 LED99.1-DOUT
DI101
  Top 0.3: LED101.3-DIN 45.1,14.7 45.44,14.7 45.69,14.95 45.69,15.2 45.91,15.41 LED100.1-DOUT
DI102
  Top 0.3: LED102.3-DIN 45.08,12.3 45.39,12.3 45.69,12.6 45.69,12.8 45.92,13.04 LED101.1-DOUT
DI103
  Top 0.3: LED103.3-DIN 45.06,9.9 45.39,9.9 45.69,10.2 45.69,10.4 45.95,10.65 LED102.1-DOUT
DI104
  Top 0.3: LED104.3-DIN 45.04,7.5 45.39,7.5 45.69,7.8 45.69,8 45.97,8.28 LED103.1-DOUT
DI105
  Top 0.3: LED105.3-DIN 45.12,5.2 45.44,5.2 45.69,5.45 45.69,5.6 45.98,5.89 LED104.1-DOUT
DILS
  Top 0.3: R3.1 6.8,15.62 7.56,16.41 U$1.4 8.07,17.32 8.43,17.59 8.43,17.93 8.82,18.32 R7.1
DO
  Top 0.3: LED105.1-DOUT 46.6,3.7 46.91,3.7 47.51,4.3 48.85,4.3 JP1.1
GND  (via drill 0.2)
  Top 0.2: 7.55,13.1 7.14,13.1 | 7.14,13.1 CON1.A1 | 7.14,13.1 CON1.B12 | 7.6,6.7 7.14,6.7 CON1.B1
  Top 0.3: 9.7,15.8 9.2,15.8 8.9,15.5 | 9.7,3.9 8.9,3.9 | v9.97,15.8 9.97,15.13 10,15.1
  Top 0.4: 7.8,5.7 7.8,6.6 v7.9,6.7 | 7.9,13.4 7.9,14.3
  Top 0.58: v7.9,6.7 7.6,6.7 | v7.92,13.1 7.55,13.1
  other vias: 43.14,22.25 8.43,9.89 10.55,20.6 4.49,17.95 8.95,19.55 5.09,21.21 46.58,21.28 40.64,22.25 38.04,22.25 35.54,22.25 33.04,22.25 30.44,22.15 27.94,22.15 25.44,22.15 22.84,22.15 20.34,22.15 17.74,22.15 17.74,20.9 27.94,20.9 22.84,20.9 30.44,20.95 10.94,22.2 25.44,20.95 43.24,20.95 10.14,1.95 10.14,0.55 7.64,0.55 4.94,0.55 12.64,1.95 12.64,0.55 15.24,1.95 15.24,0.55 17.74,1.95 17.74,0.55 20.34,1.95 20.34,0.65 22.84,1.95 22.84,0.65 25.34,1.95 25.34,0.65 27.94,1.95 27.94,0.65 30.44,1.95 30.44,0.65 35.54,2.05 33.04,0.65 35.54,0.65 38.14,1.95 38.14,0.65 40.64,1.95 40.64,0.65 43.14,1.95 43.14,0.65 45.84,0.65 45.84,1.95 46.04,22.15 4.84,22.15 1.3,18.03 0.74,13.45 2.94,11.35 0.74,9.95 0.64,7.85 0.64,5.95 0.64,4.45 5.14,2.75 5.39,11.65 2.03,8.18 3.44,7.45 7.84,4.15 48.85,14.48 49.22,22.03 49.97,19.03 5.54,8.05 50.15,3.85 3.44,10.25 49.54,1.15 10.27,13.78 47.04,0.85 10.27,6.03 0.84,14.95 33.04,21.05 47.32,12.3 47.62,14.1 13.1,18.59 13.1,16.21 13.1,13.83 13.1,11.45 13.1,9.07 13.1,6.69 13.1,4.31 15.48,16.21 17.86,16.21 15.48,18.59 17.86,18.59 20.24,18.59 22.62,18.59 25,18.59 27.38,18.59 29.76,18.59 32.14,18.59 34.52,18.59 36.9,18.59 39.28,18.59 41.66,18.59 44.04,18.59 20.24,16.21 22.62,16.21 25,16.21 27.38,16.21 29.76,16.21 32.14,16.21 34.52,16.21 36.9,16.21 15.48,13.83 17.86,13.83 20.24,13.83 22.62,13.83 25,13.83 27.38,13.83 29.76,13.83 32.14,13.83 34.52,13.83 36.9,13.83 15.48,11.45 17.86,11.45 20.24,11.45 22.62,11.45 25,11.45 27.38,11.45 29.76,11.45 32.14,11.45 34.52,11.45 36.9,11.45 15.48,9.07 17.86,9.07 20.24,9.07 22.62,9.07 25,9.07 27.38,9.07 29.76,9.07 32.14,9.07 34.52,9.07 36.9,9.07 15.48,6.69 17.86,6.69 20.24,6.69 22.62,6.69 25,6.69 27.38,6.69 29.76,6.69 32.14,6.69 34.52,6.69 36.9,6.69 15.48,4.31 17.86,4.31 20.24,4.31 22.62,4.31 25,4.31 27.38,4.31 29.76,4.31 32.14,4.31 34.52,4.31 36.9,4.31 39.28,4.31 41.66,4.31 44.04,4.31 46.42,4.31 39.28,6.69 41.66,6.69 44.04,6.69 46.42,6.69 39.28,9.07 41.66,9.07 44.04,9.07 46.42,9.07 39.28,11.45 41.66,11.45 44.04,11.45 46.42,11.45 39.28,13.83 41.66,13.83 44.04,13.83 46.42,13.83 39.28,16.21 41.66,16.21 44.04,16.21 46.42,16.21 46.43,20.62 10.27,3.92 2.24,6.85 38.14,20.95 48.22,17.25 47.32,10.5 48.35,5.55 48.92,8.7 7.77,6.09 0.76,11.71 7.87,15.5 7.87,14.8 7.87,4.99 7.85,13.7
  pour Bottom (rank 2): 0,23 51,23 51,0 0,0
  pour Route2: 0,23 51,23 51,0 0,0
  pour Top (rank 2): 0,23 51,23 51,0 0,0
GPIO6  (via drill 0.2)
  Top 0.3: MS1.20 35.24,20 v12.35,20 | v10.8,18.8 10.8,18.76 R9.1
  Bottom 0.3: v12.35,20 11.15,18.8 v10.8,18.8
GPIO12
  Bottom 0.3: MS1.24 R4.1
MOSI  (via drill 0.2)
  Top 0.3: MS1.12 32.86,2.7 10.6,2.7 10,3.3 5.5,3.3 4.2,4.6 4.2,7.7 v2.1,9.8
  Bottom 0.3: R10.1 2.1,10.65 v2.1,9.8
N$2
  Top 0.3: CON1.A5 8.08,11.15 R1.2
N$3
  Top 0.28: CON1.B5 7.91,8.15 8.05,8.29 R2.1
  Top 0.3: 8.34,8.2 R2.1
N$5
  Top 0.3: U$1.3 3.5,17.32 R5.1
N$6
  Top 0.3: D1.2 1.36,16.3 R6.1
PROG  (via drill 0.2)
  Top 0.3: S2.7 S2.1 48.25,12.5 v48.25,15 48.25,15.9 S2.8
  Bottom 0.3: MS1.19 41.16,19.8 45.35,19.8 47.15,18 47.15,15.75 47.9,15 v48.25,15
USB
  Bottom 0.55: MS1.26 R8.1
VBAT
  Top 1.6: MS1.28 15.19,21.59 14.91,21.31 D2.A
VDD  (via drill 0.2)
  Top 0.3: v2.23,17.9 2.23,17.38 R6.2 | LED8.2-VDD v13.99,18.49 | LED15.2-VDD v16.37,18.49 | LED22.2-VDD v18.75,18.49 | LED29.2-VDD v21.13,18.49 | LED2.2-VDD v11.61,16.11 | LED3.2-VDD v11.61,13.73 | LED10.2-VDD v13.99,13.73 | LED9.2-VDD v13.99,16.11 | LED17.2-VDD v16.37,13.73 | LED16.2-VDD v16.37,16.11 | LED23.2-VDD v18.75,16.11 | LED24.2-VDD v18.75,13.73 | LED31.2-VDD v21.13,13.73 | LED30.2-VDD v21.13,16.11 | LED38.2-VDD v23.51,13.73 | LED37.2-VDD v23.51,16.11 | LED36.2-VDD v23.51,18.49 | LED43.2-VDD v25.89,18.49 | LED44.2-VDD v25.89,16.11 | LED45.2-VDD v25.89,13.73 | LED52.2-VDD v28.27,13.73 | LED51.2-VDD v28.27,16.11 | LED50.2-VDD v28.27,18.49 | LED59.2-VDD v30.65,13.73 | LED58.2-VDD v30.65,16.11 | LED57.2-VDD v30.65,18.49 | LED64.2-VDD v33.03,18.49 | LED65.2-VDD v33.03,16.11 | LED66.2-VDD v33.03,13.73 | LED73.2-VDD v35.41,13.73 | LED80.2-VDD v37.79,13.73 | LED79.2-VDD v37.79,16.11 | LED72.2-VDD v35.41,16.11 | LED71.2-VDD v35.41,18.49 | LED78.2-VDD v37.79,18.49 | LED85.2-VDD v40.17,18.49 | LED92.2-VDD v42.55,18.49 | LED99.2-VDD v44.93,18.49 | LED100.2-VDD v44.93,16.11 | LED93.2-VDD v42.55,16.11 | LED86.2-VDD v40.17,16.11 | LED87.2-VDD v40.17,13.73 | LED94.2-VDD v42.55,13.73 | LED101.2-VDD v44.93,13.73 | LED102.2-VDD v44.93,11.35 | LED103.2-VDD v44.93,8.97 | LED96.2-VDD v42.55,8.97 | LED95.2-VDD v42.55,11.35 | LED88.2-VDD v40.17,11.35 | LED89.2-VDD v40.17,8.97 | LED82.2-VDD v37.79,8.97 | LED81.2-VDD v37.79,11.35 | LED74.2-VDD v35.41,11.35 | LED75.2-VDD v35.41,8.97 | LED68.2-VDD v33.03,8.97 | LED67.2-VDD v33.03,11.35 | LED61.2-VDD v30.65,8.97 | LED60.2-VDD v30.65,11.35 | LED53.2-VDD v28.27,11.35 | LED54.2-VDD v28.27,8.97 | LED47.2-VDD v25.89,8.97 | LED46.2-VDD v25.89,11.35
  Top 0.3: LED39.2-VDD v23.51,11.35 | LED40.2-VDD v23.51,8.97 | LED33.2-VDD v21.13,8.97 | LED32.2-VDD v21.13,11.35 | LED26.2-VDD v18.75,8.97 | LED25.2-VDD v18.75,11.35 | LED18.2-VDD v16.37,11.35 | LED11.2-VDD v13.99,11.35 | LED12.2-VDD v13.99,8.97 | LED19.2-VDD v16.37,8.97 | LED4.2-VDD v11.61,11.35 | LED5.2-VDD v11.61,8.96 v11.61,8.97 | LED7.2-VDD v11.6,4.19 | LED6.2-VDD 11.63,5.92 v11.63,6.59 | LED14.2-VDD v13.98,4.19 | LED13.2-VDD 14.01,5.92 v14.01,6.59 | LED20.2-VDD 16.39,5.92 v16.39,6.59 | LED21.2-VDD v16.36,4.19 | LED28.2-VDD v18.74,4.19 | LED27.2-VDD 18.77,5.92 v18.77,6.59 | LED35.2-VDD v21.12,4.19 | LED34.2-VDD 21.15,5.92 v21.15,6.59 | LED41.2-VDD 23.53,5.92 v23.53,6.59 | LED42.2-VDD v23.5,4.19 | LED49.2-VDD v25.88,4.19 | LED48.2-VDD 25.91,5.92 v25.91,6.59 | LED56.2-VDD v28.26,4.19 | LED55.2-VDD 28.29,5.92 v28.29,6.59 | LED63.2-VDD v30.64,4.19 | LED62.2-VDD 30.67,5.92 v30.67,6.59 | LED70.2-VDD v33.02,4.19 | LED69.2-VDD 33.05,5.92 v33.05,6.59 | LED77.2-VDD v35.4,4.19 | LED76.2-VDD 35.43,5.92 v35.43,6.59 | LED84.2-VDD v37.78,4.19 | LED83.2-VDD 37.81,5.92 v37.81,6.59 | LED90.2-VDD 40.19,5.92 v40.19,6.59 | LED91.2-VDD v40.16,4.19 | LED98.2-VDD v42.54,4.19 | LED97.2-VDD 42.57,5.92 v42.57,6.59 | LED104.2-VDD 44.95,5.92 v44.95,6.59 | LED105.2-VDD v44.92,4.19 | v11.71,18.49 11.71,17.9 arc-90 LED1.2-VDD | v48.04,4.92 47.41,4.92 C8.1 | v48.4,18.47 48.2,18.27 C7.1 | v7.2,20.15 7.2,19.6 C2.2 7.45,19.35 7.45,18.73 U$1.6 | 10.7,16.95 C9.1 10.7,17 10.65,17.05 10.65,17.26 v10.88,17.49
  Top 0.6: 9.55,9.81 9.55,10.5 | 9.55,8.91 9.55,9.6 | F1.2 10.08,10.59 v9.9,10.77 | F2.2 10.13,9.21 v9.89,8.97
  Bottom 0.3: ST1.1 49.8,14.15 49.8,13.8 49.73,13.73 v48.93,13.73
  other vias: 9.21,11.47 9.89,11.47 9.21,10.77 9.21,8.97 9.89,8.26 9.21,8.27 9.21,9.57 9.21,10.17 9.91,10.17 9.91,9.57
  pour Route15 (isolate 0.3): 0,23 51,23 51,0 0,0
  pour Top: 9,11.7 10.2,11.7 10.2,8.1 9,8.1
VDDFF1
  Top 0.3: 9.2,12.3 L1.P$1
  Top 0.6: 9.2,12.3 9.97,12.3 C4.P$1 10.72,12.15 F1.1
VDDFF2
  Top 0.3: L2.P$1 9.2,7.5
  Top 0.6: 9.2,7.5 9.97,7.5 C3.P$1 10.72,7.65 F2.1

### Text on the board
tNames: D2 | +7 | +1 | LED1 | LED8 | LED99 | - | LED7 | LED / 105
bNames: eiPal Optoelectronics, 2024 | VDD | Prog | Würth Elektronik eiSos GmbH & Co. KG / Max-Eyth-Straße 1 / 74638 Waldenburg / Germany | R10 | For evaluation only!! / For professional use only! | GND | Reset | ICLED Featherwing (150015) | Hardware v1.0 | C:/Users/c.hernandezgomez/Desktop/Eagle Logos/WE_Logo.bmp
tprint: BAT | EN | USB | 13 | 12 | 11 | 10 | 9 | 6 | 5 | SCL | SDA | DI | Power | R5 | R9 | Prog | Reset | 5V / 3A | RST | 3V3 | AREF | GND | A0 | A1 | A2 | A3 | A4 | A5 | SCK | MOSI | MISO | RX0 | TX1 | NC | DO